# EAGLE schematic RAFT_DuckLink_RFH (EAGLE 9.5.2)

## Sheet 1 of 7
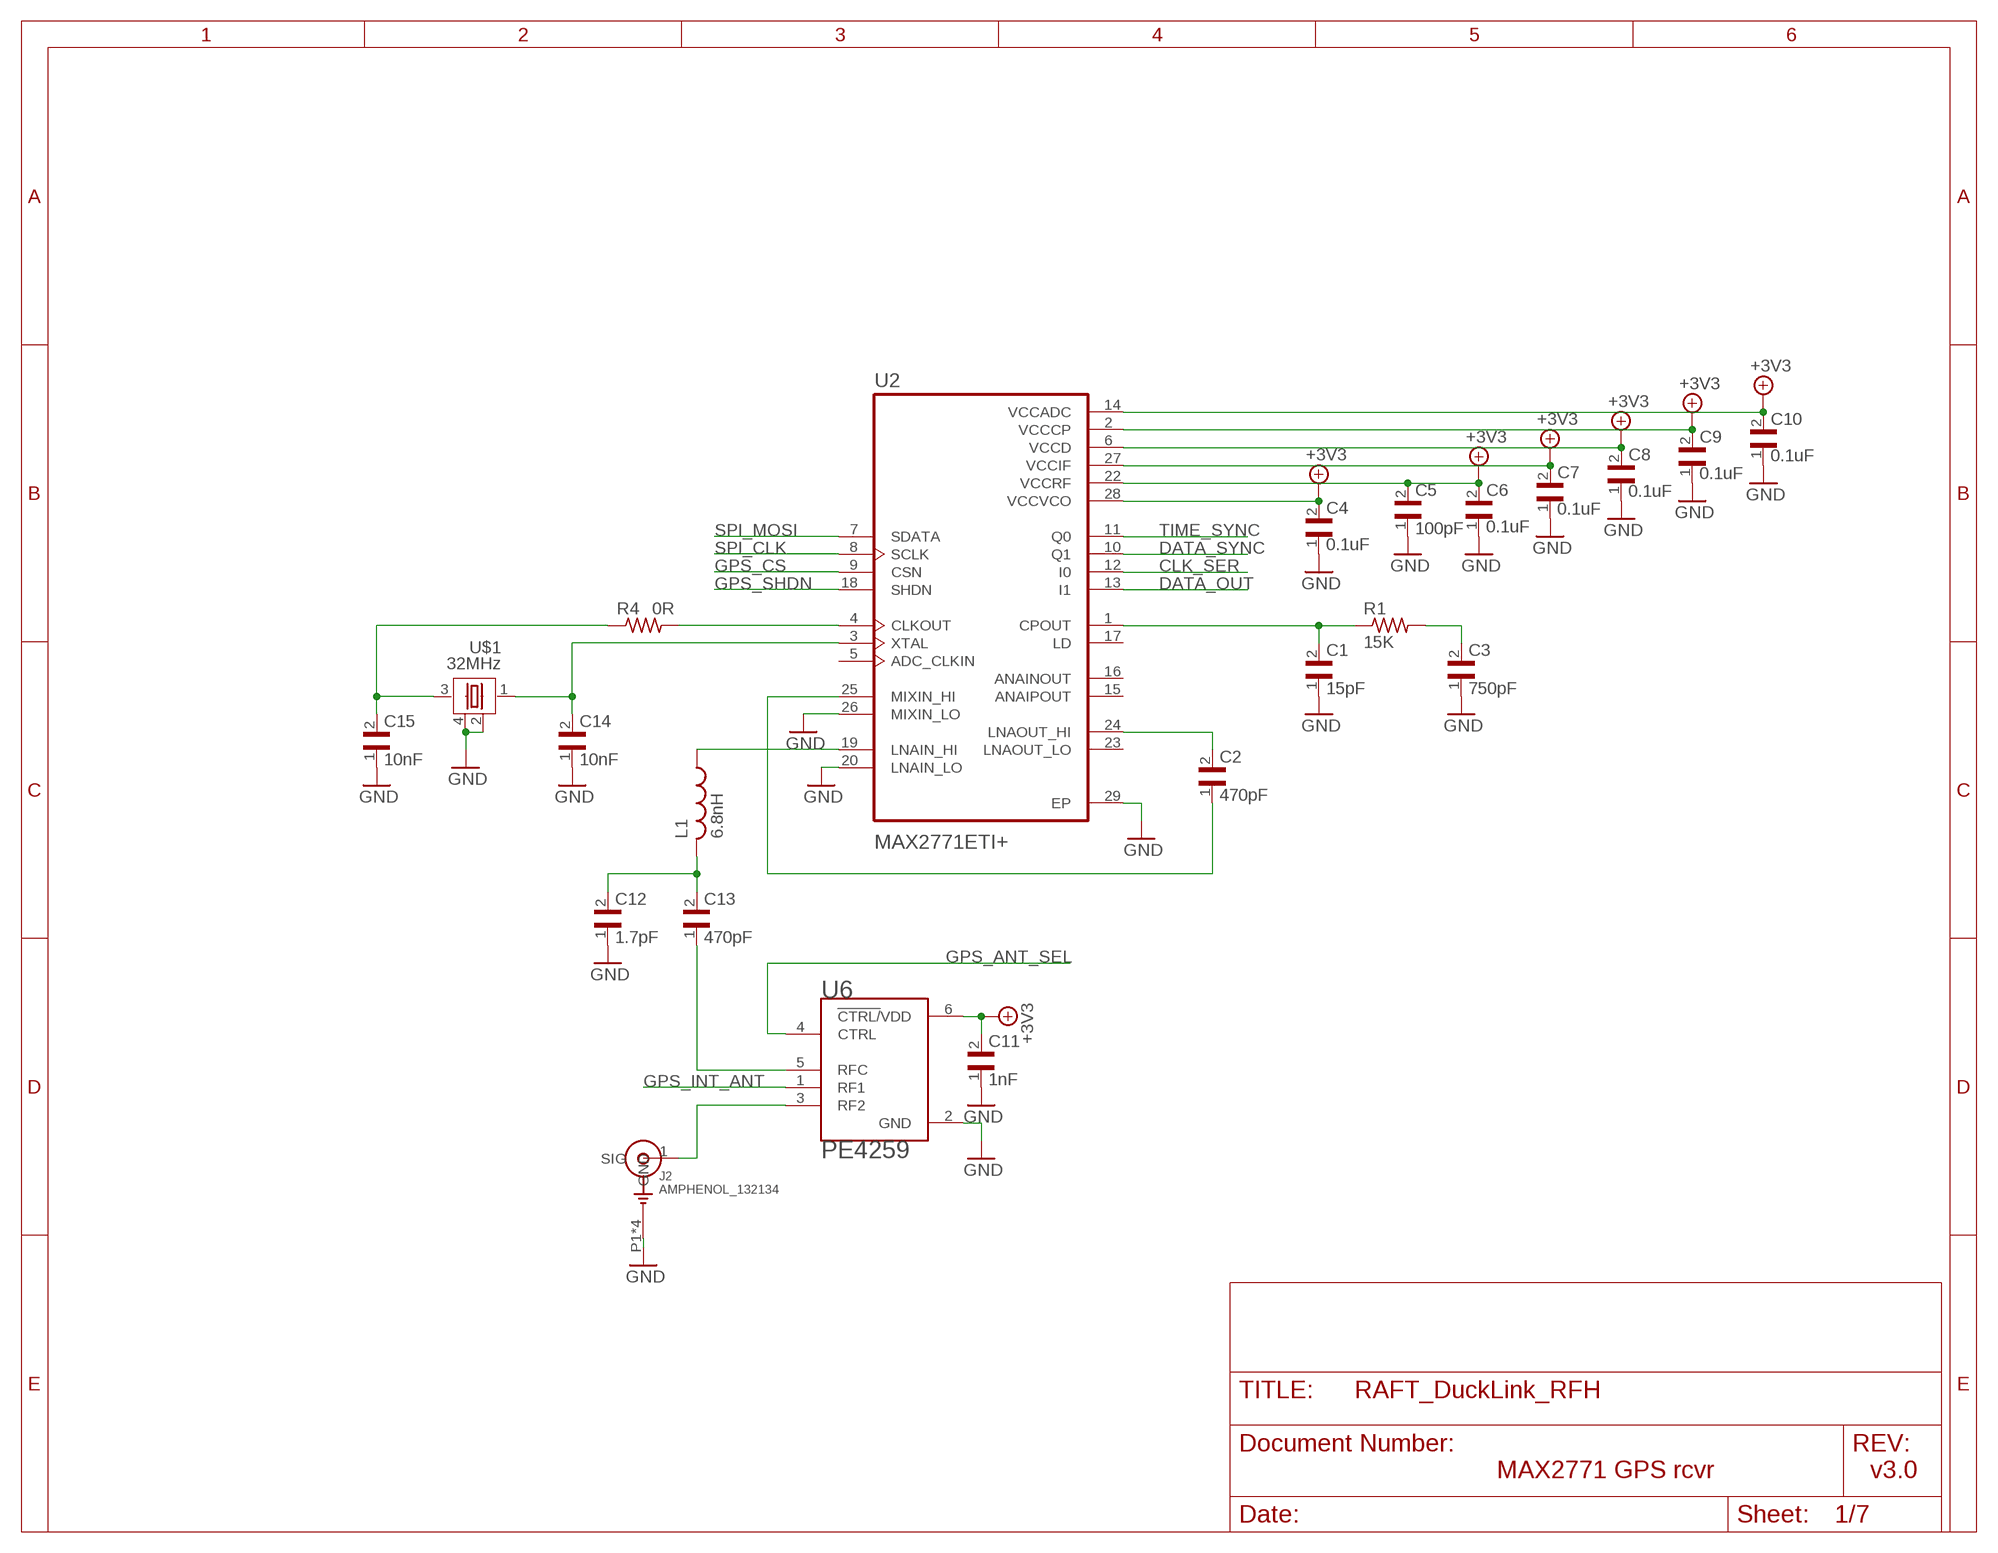
[diagram p0: schematic, sheet 1]

### Parts
C1  15pF  GCM1555C1H150JA16D  [CAPC1005X55N]
C2  470pF  GCM1555C1H471JA16D  [CAPC1005X55N]
C3  750pF  GCM1885C2A751JA16D  [CAPC1608X90N]
C4  0.1uF  GCM155R71C104KA55J  [CAPC1005X55N]
C5  100pF  GCM1555C1H101JA16D  [CAPC1005X55N]
C6  0.1uF  GCM155R71C104KA55J  [CAPC1005X55N]
C7  0.1uF  GCM155R71C104KA55J  [CAPC1005X55N]
C8  0.1uF  GCM155R71C104KA55J  [CAPC1005X55N]
C9  0.1uF  GCM155R71C104KA55J  [CAPC1005X55N]
C10  0.1uF  GCM155R71C104KA55J  [CAPC1005X55N]
C11  1nF  GCM155R71H102KA37D  [CAPC1005X55N]
C12  1.7pF  GCM1555C1H1R7CA16D  [CAPC1005X55N]
C13  470pF  GCM1555C1H471JA16D  [CAPC1005X55N]
C14  10nF  GCM155R71H103KA55D  [CAPC1005X55N]
C15  10nF  GCM155R71H103KA55D  [CAPC1005X55N]
J2  AMPHENOL_132134  [AMPHENOL_132134-15]
L1  6.8nH  LQG15HS6N8J02D  [INDC1005X55N]
R1  15K  CRCW040215K0JNED  [RESC1005X40N]
R4  0R  CRCW04020000Z0ED  [RESC1005X40N]
U2  MAX2771ETI+  [QFN50P500X500X80-29N]
U6  PE4259  [SOT65P215X110-6N]
U$1  32MHz  NX2016SA-32M  [SMD-4]

### Nets
+3.3V: C4.2 C5.2 C6.2 C7.2 C8.2 C9.2 C10.2 C11.2 U2.2(VCCCP) U2.6(VCCD) U2.14(VCCADC) U2.22(VCCRF) U2.27(VCCIF) U2.28(VCCVCO) U6.6(!CTRL/!VDD) ; supply symbol labelled +3V3 ; also sheet 2,3,5
CLK_SER: U2.12(I0) ; also sheet 3
DATA_OUT: U2.13(I1) ; also sheet 3
DATA_SYNC: U2.10(Q1) ; also sheet 3
GND: C1.1 C3.1 C4.1 C5.1 C6.1 C7.1 C8.1 C9.1 C10.1 C11.1 C12.1 C14.1 C15.1 J2.P1(GND) J2.P2(GND) J2.P3(GND) J2.P4(GND) U2.20(LNAIN_LO) U2.26(MIXIN_LO) U2.29(EP) U6.2(GND) U$1.2 U$1.4 ; also sheet 2,3,4,5,6,7
GPS_ANT_SEL: U6.4(CTRL) ; also sheet 3
GPS_CS: U2.9(CSN) ; also sheet 3
GPS_INT_ANT: U6.1(RF1) ; also sheet 7
GPS_SHDN: U2.18(SHDN) ; also sheet 3
N$1: C1.2 R1.1 U2.1(CPOUT)
N$2: C3.2 R1.2
N$3: C2.2 U2.24(LNAOUT_HI)
N$4: C2.1 U2.25(MIXIN_HI)
N$5: L1.1 U2.19(LNAIN_HI)
N$6: C13.1 U6.5(RFC)
N$7: J2.1(SIG) U6.3(RF2)
N$8: C12.2 C13.2 L1.2
N$9: C15.2 R4.1 U$1.3
N$11: C14.2 U2.3(XTAL) U$1.1
N$33: R4.2 U2.4(CLKOUT)
SPI_CLK: U2.8(SCLK) ; also sheet 2,3,7
SPI_MOSI: U2.7(SDATA) ; also sheet 2,3,7
TIME_SYNC: U2.11(Q0) ; also sheet 3
Unconnected: U2.5(ADC_CLKIN) U2.15(ANAIPOUT) U2.16(ANAINOUT) U2.17(LD) U2.23(LNAOUT_LO)

### Notes on the sheet
- MAX2771 GPS rcvr | v3.0

## Sheet 2 of 7
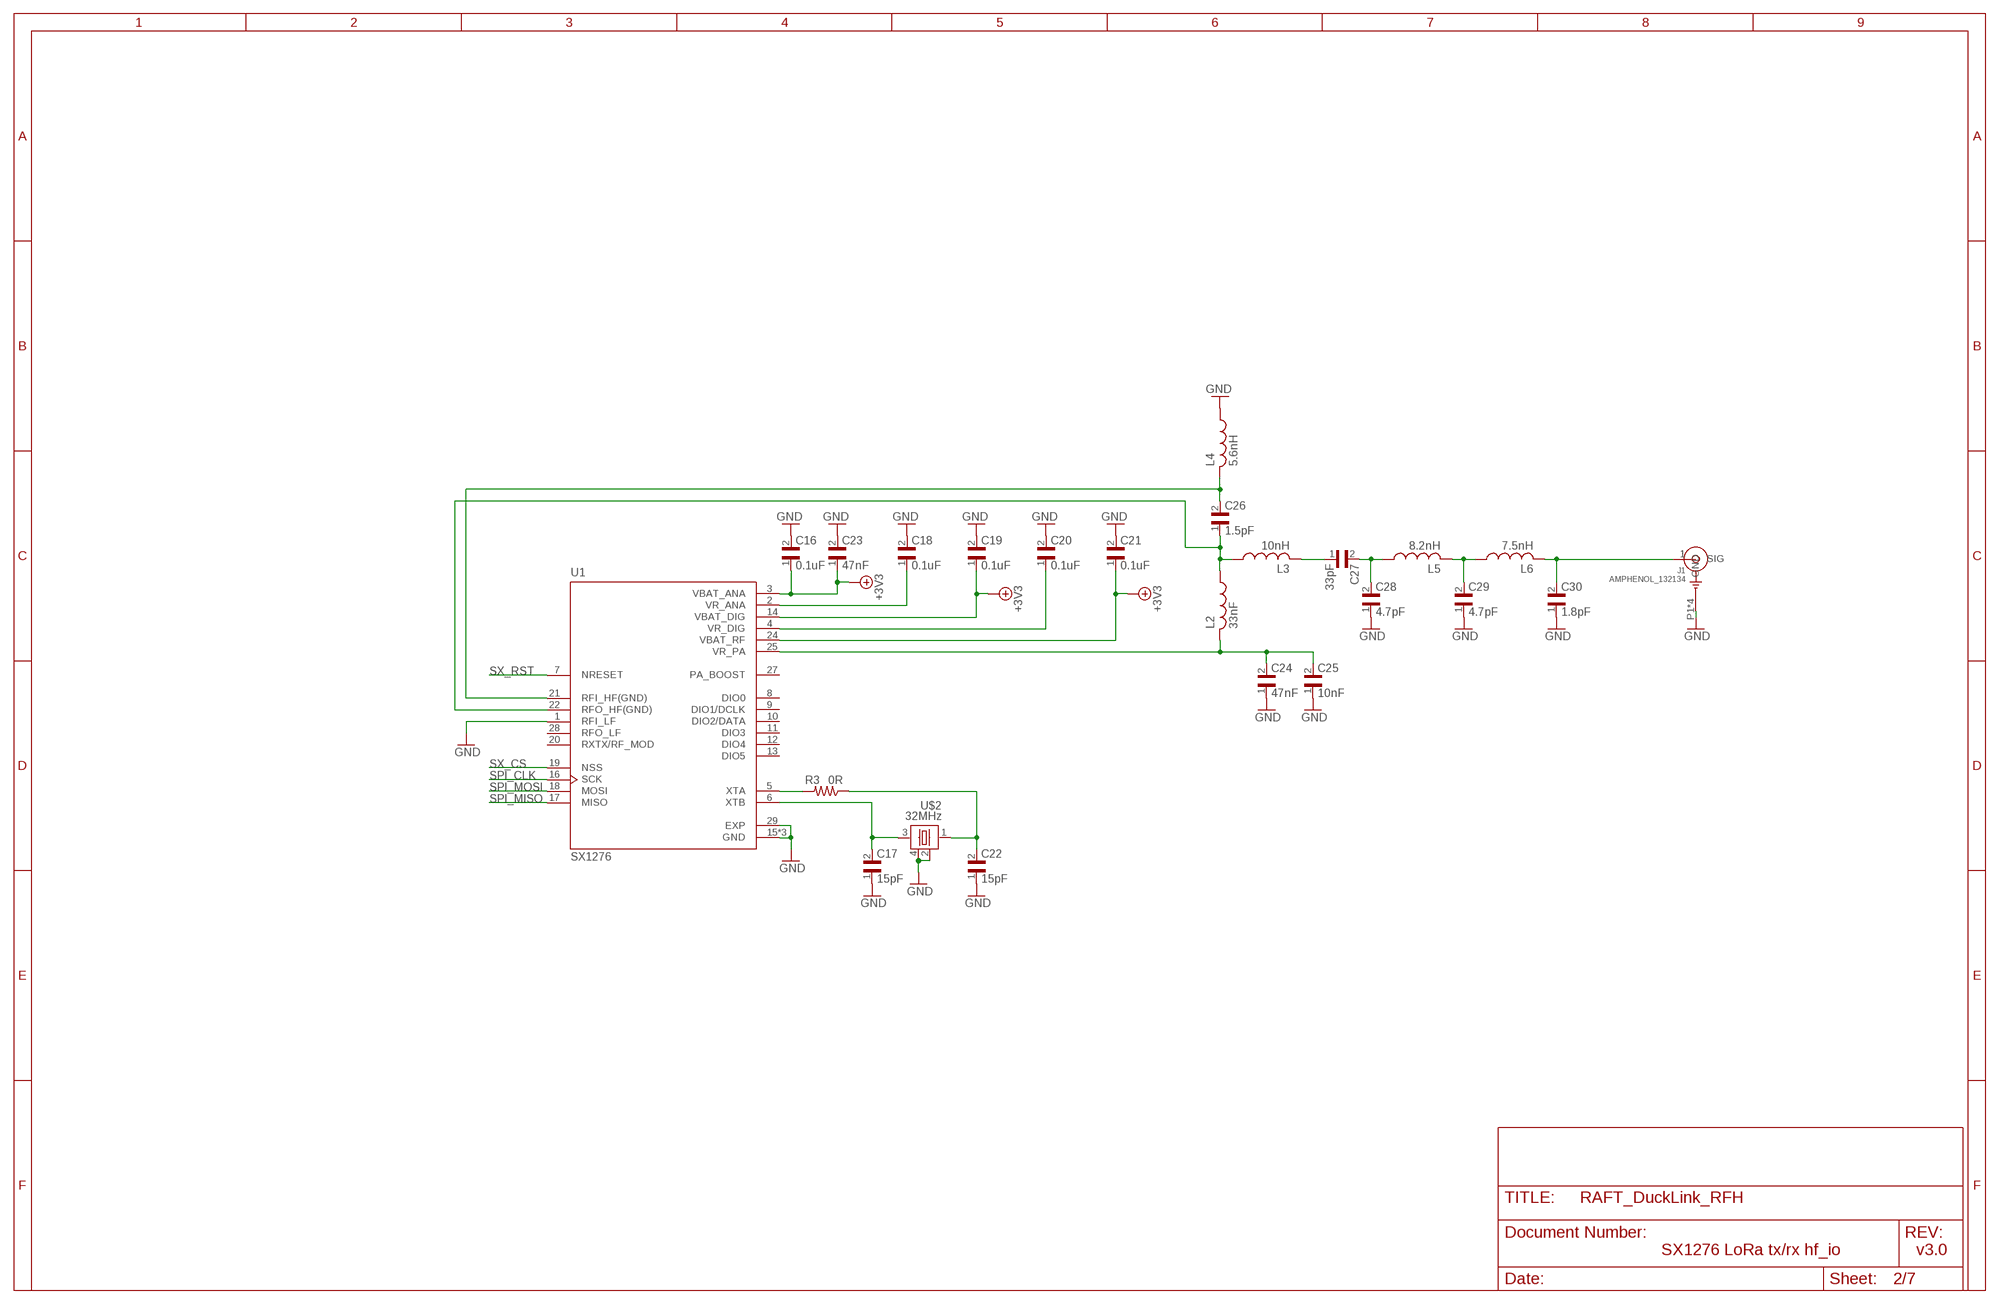
[diagram p1: schematic, sheet 2]

### Parts
C16  0.1uF  GCM155R71C104KA55J  [CAPC1005X55N]
C17  15pF  GCM1555C1H150JA16D  [CAPC1005X55N]
C18  0.1uF  GCM155R71C104KA55J  [CAPC1005X55N]
C19  0.1uF  GCM155R71C104KA55J  [CAPC1005X55N]
C20  0.1uF  GCM155R71C104KA55J  [CAPC1005X55N]
C21  0.1uF  GCM155R71C104KA55J  [CAPC1005X55N]
C22  15pF  GCM1555C1H150JA16D  [CAPC1005X55N]
C23  47nF  GCM155R71C473KA37D  [CAPC1005X55N]
C24  47nF  GCM155R71C473KA37D  [CAPC1005X55N]
C25  10nF  GCM155R71H103KA55D  [CAPC1005X55N]
C26  1.5pF  GCM1555C1H1R5JA16D  [CAPC1005X55N]
C27  33pF  GCM1555C1H330JA16D  [CAPC1005X55N]
C28  4.7pF  GCM1555C1H4R7CA16D  [CAPC1005X55N]
C29  4.7pF  GCM1555C1H4R7CA16D  [CAPC1005X55N]
C30  1.8pF  GCM1555C1H1R8CA16D  [CAPC1005X55N]
J1  AMPHENOL_132134  [AMPHENOL_132134-15]
L2  33nF  LQG15HS33NJ02D  [INDC1005X55N]
L3  10nH  LQG15HS10NJ02D  [INDC1005X55N]
L4  5.6nH  LQG15HS5N6C02D  [INDC1005X55N]
L5  8.2nH  LQG15HS8N2J02D  [INDC1005X55N]
L6  7.5nH  LQG15HN7N5H02D  [INDC1005X55N]
R3  0R  CRCW04020000Z0ED  [RESC1005X40N]
U1  SX1276  [QFN65P600X600X100-29N]
U$2  32MHz  NX2016SA-32M  [SMD-4]

### Nets
+3.3V: C16.1 C19.1 C21.1 C23.1 U1.3(VBAT_ANA) U1.14(VBAT_DIG) U1.24(VBAT_RF) ; supply symbol labelled +3V3 ; also sheet 1,3,5
GND: C16.2 C17.1 C18.2 C19.2 C20.2 C21.2 C22.1 C23.2 C24.1 C25.1 C28.1 C29.1 C30.1 J1.P1(GND) J1.P2(GND) J1.P3(GND) J1.P4(GND) L4.1 U1.1(RFI_LF) U1.15(GND) U1.23(GND) U1.26(GND) U1.29(EXP) U$2.2 U$2.4 ; also sheet 1,3,4,5,6,7
N$10: C24.2 C25.2 L2.2 U1.25(VR_PA)
N$12: C18.1 U1.2(VR_ANA)
N$13: C22.2 R3.1 U$2.1
N$14: C20.1 U1.4(VR_DIG)
N$15: C17.2 U1.6(XTB) U$2.3
N$16: C26.1 L2.1 L3.1 U1.22(RFO_HF(GND))
N$17: C26.2 L4.2 U1.21(RFI_HF(GND))
N$18: C27.1 L3.2
N$19: C27.2 C28.2 L5.1
N$20: C29.2 L5.2 L6.1
N$21: C30.2 J1.1(SIG) L6.2
N$31: R3.2 U1.5(XTA)
SPI_CLK: U1.16(SCK) ; also sheet 1,3,7
SPI_MISO: U1.17(MISO) ; also sheet 3,7
SPI_MOSI: U1.18(MOSI) ; also sheet 1,3,7
SX_CS: U1.19(NSS) ; also sheet 3
SX_RST: U1.7(NRESET) ; also sheet 3
Unconnected: U1.8(DIO0) U1.9(DIO1/DCLK) U1.10(DIO2/DATA) U1.11(DIO3) U1.12(DIO4) U1.13(DIO5) U1.20(RXTX/RF_MOD) U1.27(PA_BOOST) U1.28(RFO_LF)

### Notes on the sheet
- SX1276 LoRa tx/rx hf_io | v3.0

## Sheet 3 of 7
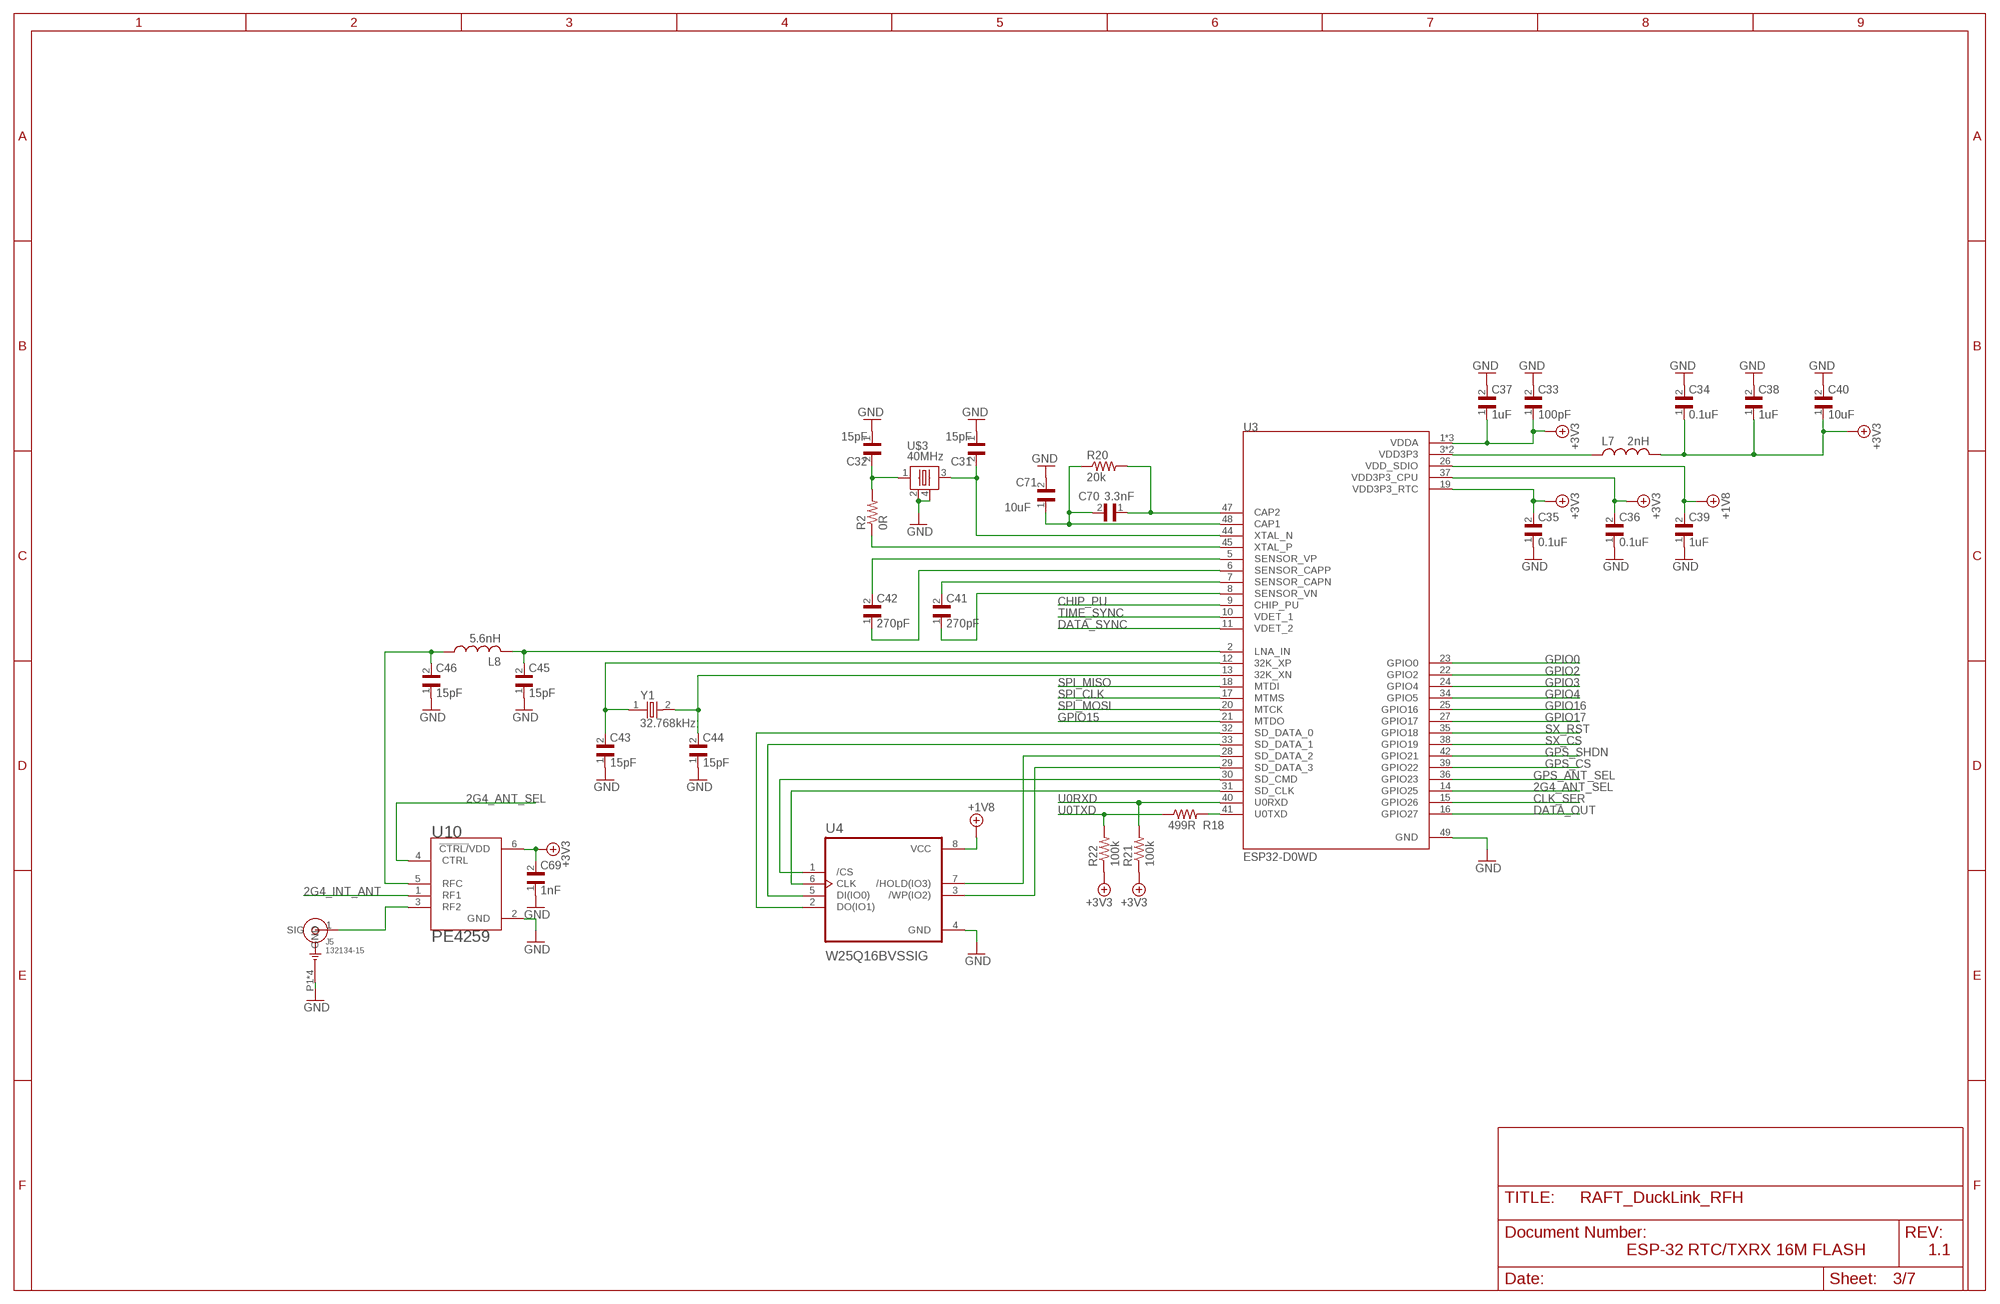
[diagram p2: schematic, sheet 3]

### Parts
C31  15pF  GCM1555C1H150JA16D  [CAPC1005X55N]
C32  15pF  GCM1555C1H150JA16D  [CAPC1005X55N]
C33  100pF  GCM1555C1H101JA16D  [CAPC1005X55N]
C34  0.1uF  GCM155R71C104KA55J  [CAPC1005X55N]
C35  0.1uF  GCM155R71C104KA55J  [CAPC1005X55N]
C36  0.1uF  GCM155R71C104KA55J  [CAPC1005X55N]
C37  1uF  GCM155C71A105KE38D  [CAPC1005X70N]
C38  1uF  GCM155C71A105KE38D  [CAPC1005X70N]
C39  1uF  GCM155C71A105KE38D  [CAPC1005X70N]
C40  10uF  GRM155C80J106ME11D  [CAPC1005X70N]
C41  270pF  GRM1555C1H271JA01D  [CAPC1005X55N]
C42  270pF  GRM1555C1H271JA01D  [CAPC1005X55N]
C43  15pF  GCM1555C1H150JA16D  [CAPC1005X55N]
C44  15pF  GCM1555C1H150JA16D  [CAPC1005X55N]
C45  15pF  GCM1555C1H150JA16D  [CAPC1005X55N]
C46  15pF  GCM1555C1H150JA16D  [CAPC1005X55N]
C69  1nF  GCM155R71H102KA37D  [CAPC1005X55N]
C70  3.3nF  GCM155R71H332KA37D  [CAPC1005X55N]
C71  10uF  GRM155C80J106ME11D  [CAPC1005X70N]
J5  132134-15  [AMPHENOL_132134-15]
L7  2nH  LQG15HN2N0C02D  [INDC1005X55N]
L8  5.6nH  LQG15HS5N6C02D  [INDC1005X55N]
R2  0R  CRCW04020000Z0ED  [RESC1005X40N]
R18  499R  CRCW0402499RFKEDC  [RESC1005X35N]
R20  20k  CRCW040220K0FKEDC  [RESC1005X35N]
R21  100k  CRCW0402100KFKED  [RESC1005X40N]
R22  100k  CRCW0402100KFKED  [RESC1005X40N]
U3  ESP32-D0WD  [QFN35P500X500X90-49N]
U4  W25Q16BVSSIG  [SOIC127P790X216-8N]
U10  PE4259  [SOT65P215X110-6N]
U$3  40MHz  R2520-40  [SMD-4]
Y1  32.768kHz  FC-13532.768KA-AG0  [OSCCC150X320X80-2N]

### Nets
2G4_ANT_SEL: U3.14(GPIO25) U10.4(CTRL)
2G4_INT_ANT: U10.1(RF1) ; also sheet 7
+1.8V: C39.2 U3.26(VDD_SDIO) U4.8(VCC) ; supply symbol labelled +1V8
+3.3V: C33.1 C34.1 C35.2 C36.2 C37.1 C38.1 C40.1 C69.2 L7.2 R21.1 R22.1 U3.1(VDDA) U3.19(VDD3P3_RTC) U3.37(VDD3P3_CPU) U3.43(VDDA) U3.46(VDDA) U10.6(!CTRL/!VDD) ; supply symbol labelled +3V3 ; also sheet 1,2,5
CHIP_PU: U3.9(CHIP_PU) ; also sheet 7
CLK_SER: U3.15(GPIO26) ; also sheet 1
DATA_OUT: U3.16(GPIO27) ; also sheet 1
DATA_SYNC: U3.11(VDET_2) ; also sheet 1
GND: C31.1 C32.1 C33.2 C34.2 C35.1 C36.1 C37.2 C38.2 C39.1 C40.2 C43.1 C44.1 C45.1 C46.1 C69.1 C71.2 J5.P1(GND) J5.P2(GND) J5.P3(GND) J5.P4(GND) U3.49(GND) U4.4(GND) U10.2(GND) U$3.2 U$3.4 ; also sheet 1,2,4,5,6,7
GPIO0: U3.23(GPIO0) ; also sheet 7
GPIO2: U3.22(GPIO2) ; also sheet 7
GPIO3: U3.24(GPIO4) ; also sheet 7
GPIO4: U3.34(GPIO5) ; also sheet 7
GPIO15: U3.21(MTDO) ; also sheet 7
GPIO16: U3.25(GPIO16) ; also sheet 7
GPIO17: U3.27(GPIO17) ; also sheet 7
GPS_ANT_SEL: U3.36(GPIO23) ; also sheet 1
GPS_CS: U3.39(GPIO22) ; also sheet 1
GPS_SHDN: U3.42(GPIO21) ; also sheet 1
N$22: R2.1 U3.45(XTAL_P)
N$23: C31.2 U3.44(XTAL_N) U$3.3
N$24: L7.1 U3.3(VDD3P3) U3.4(VDD3P3)
N$25: C41.1 U3.8(SENSOR_VN)
N$26: C41.2 U3.7(SENSOR_CAPN)
N$27: C42.1 U3.6(SENSOR_CAPP)
N$28: C42.2 U3.5(SENSOR_VP)
N$30: C32.2 R2.2 U$3.1
N$32: R18.2 U3.41(U0TXD)
N$34: U3.30(SD_CMD) U4.1(/CS)
N$35: U3.31(SD_CLK) U4.6(CLK)
N$36: U3.28(SD_DATA_2) U4.7(/HOLD(IO3))
N$37: U3.29(SD_DATA_3) U4.3(/WP(IO2))
N$38: U3.33(SD_DATA_1) U4.5(DI(IO0))
N$39: U3.32(SD_DATA_0) U4.2(DO(IO1))
N$40: C43.2 U3.12(32K_XP) Y1.1
N$41: C46.2 L8.1 U10.5(RFC)
N$42: C44.2 U3.13(32K_XN) Y1.2
N$43: C45.2 L8.2 U3.2(LNA_IN)
N$70: J5.1(SIG) U10.3(RF2)
N$71: C70.1 R20.2 U3.47(CAP2)
N$74: C70.2 C71.1 R20.1 U3.48(CAP1)
SPI_CLK: U3.17(MTMS) ; also sheet 1,2,7
SPI_MISO: U3.18(MTDI) ; also sheet 2,7
SPI_MOSI: U3.20(MTCK) ; also sheet 1,2,7
SX_CS: U3.38(GPIO19) ; also sheet 2
SX_RST: U3.35(GPIO18) ; also sheet 2
TIME_SYNC: U3.10(VDET_1) ; also sheet 1
U0RXD: R21.2 U3.40(U0RXD) ; also sheet 5,7
U0TXD: R18.1 R22.2 ; also sheet 5,7

### Notes on the sheet
- ESP-32 RTC/TXRX 16M FLASH | 1.1

## Sheet 4 of 7
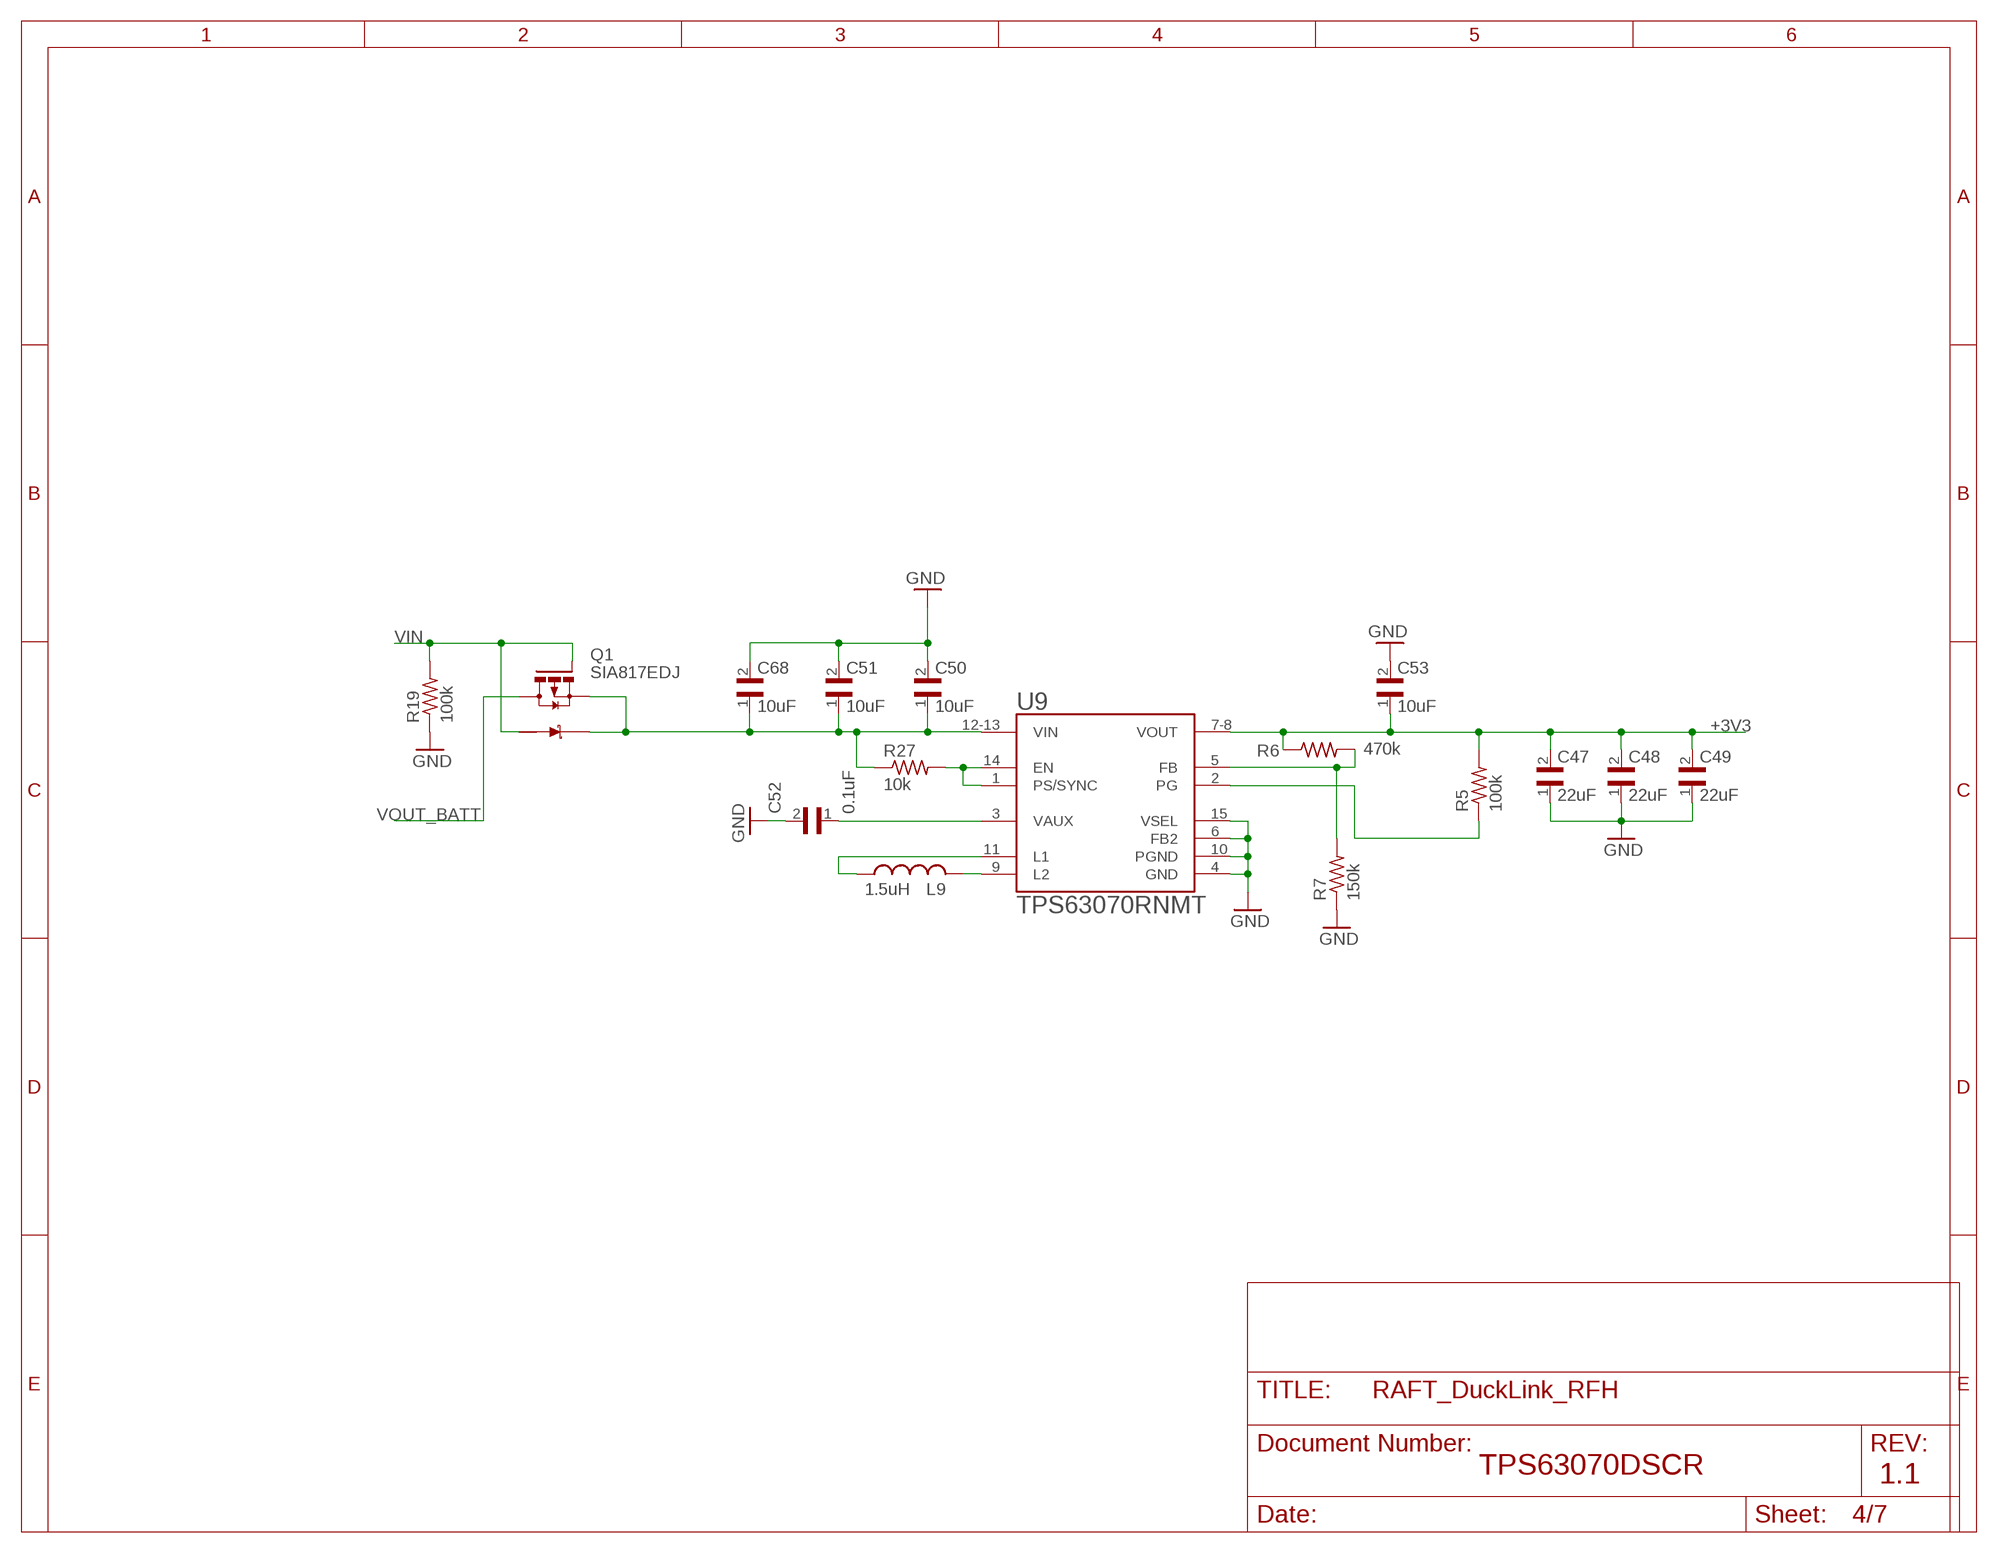
[diagram p3: schematic, sheet 4]

### Parts
C47  22uF  GRM188R60J226MEA0D  [CAPC1608X100N]
C48  22uF  GRM188R60J226MEA0D  [CAPC1608X100N]
C49  22uF  GRM188R60J226MEA0D  [CAPC1608X100N]
C50  10uF  GRM155C80J106ME11D  [CAPC1005X70N]
C51  10uF  GRM155C80J106ME11D  [CAPC1005X70N]
C52  0.1uF  GCM155R71C104KA55J  [CAPC1005X55N]
C53  10uF  GRM155C80J106ME11D  [CAPC1005X70N]
C68  10uF  GRM155C80J106ME11D  [CAPC1005X70N]
L9  1.5uH  LQM18PN1R5MFRL  [INDC1608X95N]
Q1  SIA817EDJ  [SC70-6L-DUAL]
R5  100k  CRCW0402100KFKED  [RESC1005X40N]
R6  470k  CRCW0402470KFKEDC  [RESC1005X35N]
R7  150k  CRCW0402150KFKEDC  [RESC1005X35N]
R19  100k  CRCW0402100KFKED  [RESC1005X40N]
R27  10k  CRCW040210K0JNED  [RESC1005X40N]
U9  TPS63070RNMT  [QFN50P250X300X100-15N]

### Nets
+3V3: C47.2 C48.2 C49.2 C53.1 R5.2 R6.1 U9.7-8(VOUT) ; also sheet 7
GND: C47.1 C48.1 C49.1 C50.2 C51.2 C52.2 C53.2 C68.2 R7.1 R19.1 U9.4(GND) U9.6(FB2) U9.10(PGND) U9.15(VSEL) ; also sheet 1,2,3,5,6,7
N$29: C52.1 U9.3(VAUX)
N$45: L9.1 U9.11(L1)
N$46: L9.2 U9.9(L2)
N$47: R5.1 U9.2(PG)
N$49: R6.2 R7.2 U9.5(FB)
N$57: R27.2 U9.1(PS/SYNC) U9.14(EN)
VIN: Q1.P$1(A) Q1.P$5(G) R19.2 ; also sheet 5,6
VIN_SYS: C50.1 C51.1 C68.1 Q1.P$4(S) Q1.P$6(K) R27.1 U9.12-13(VIN)
VOUT_BATT: Q1.P$3(D) ; also sheet 6

### Notes on the sheet
- TPS63070DSCR
- 1.1

## Sheet 5 of 7
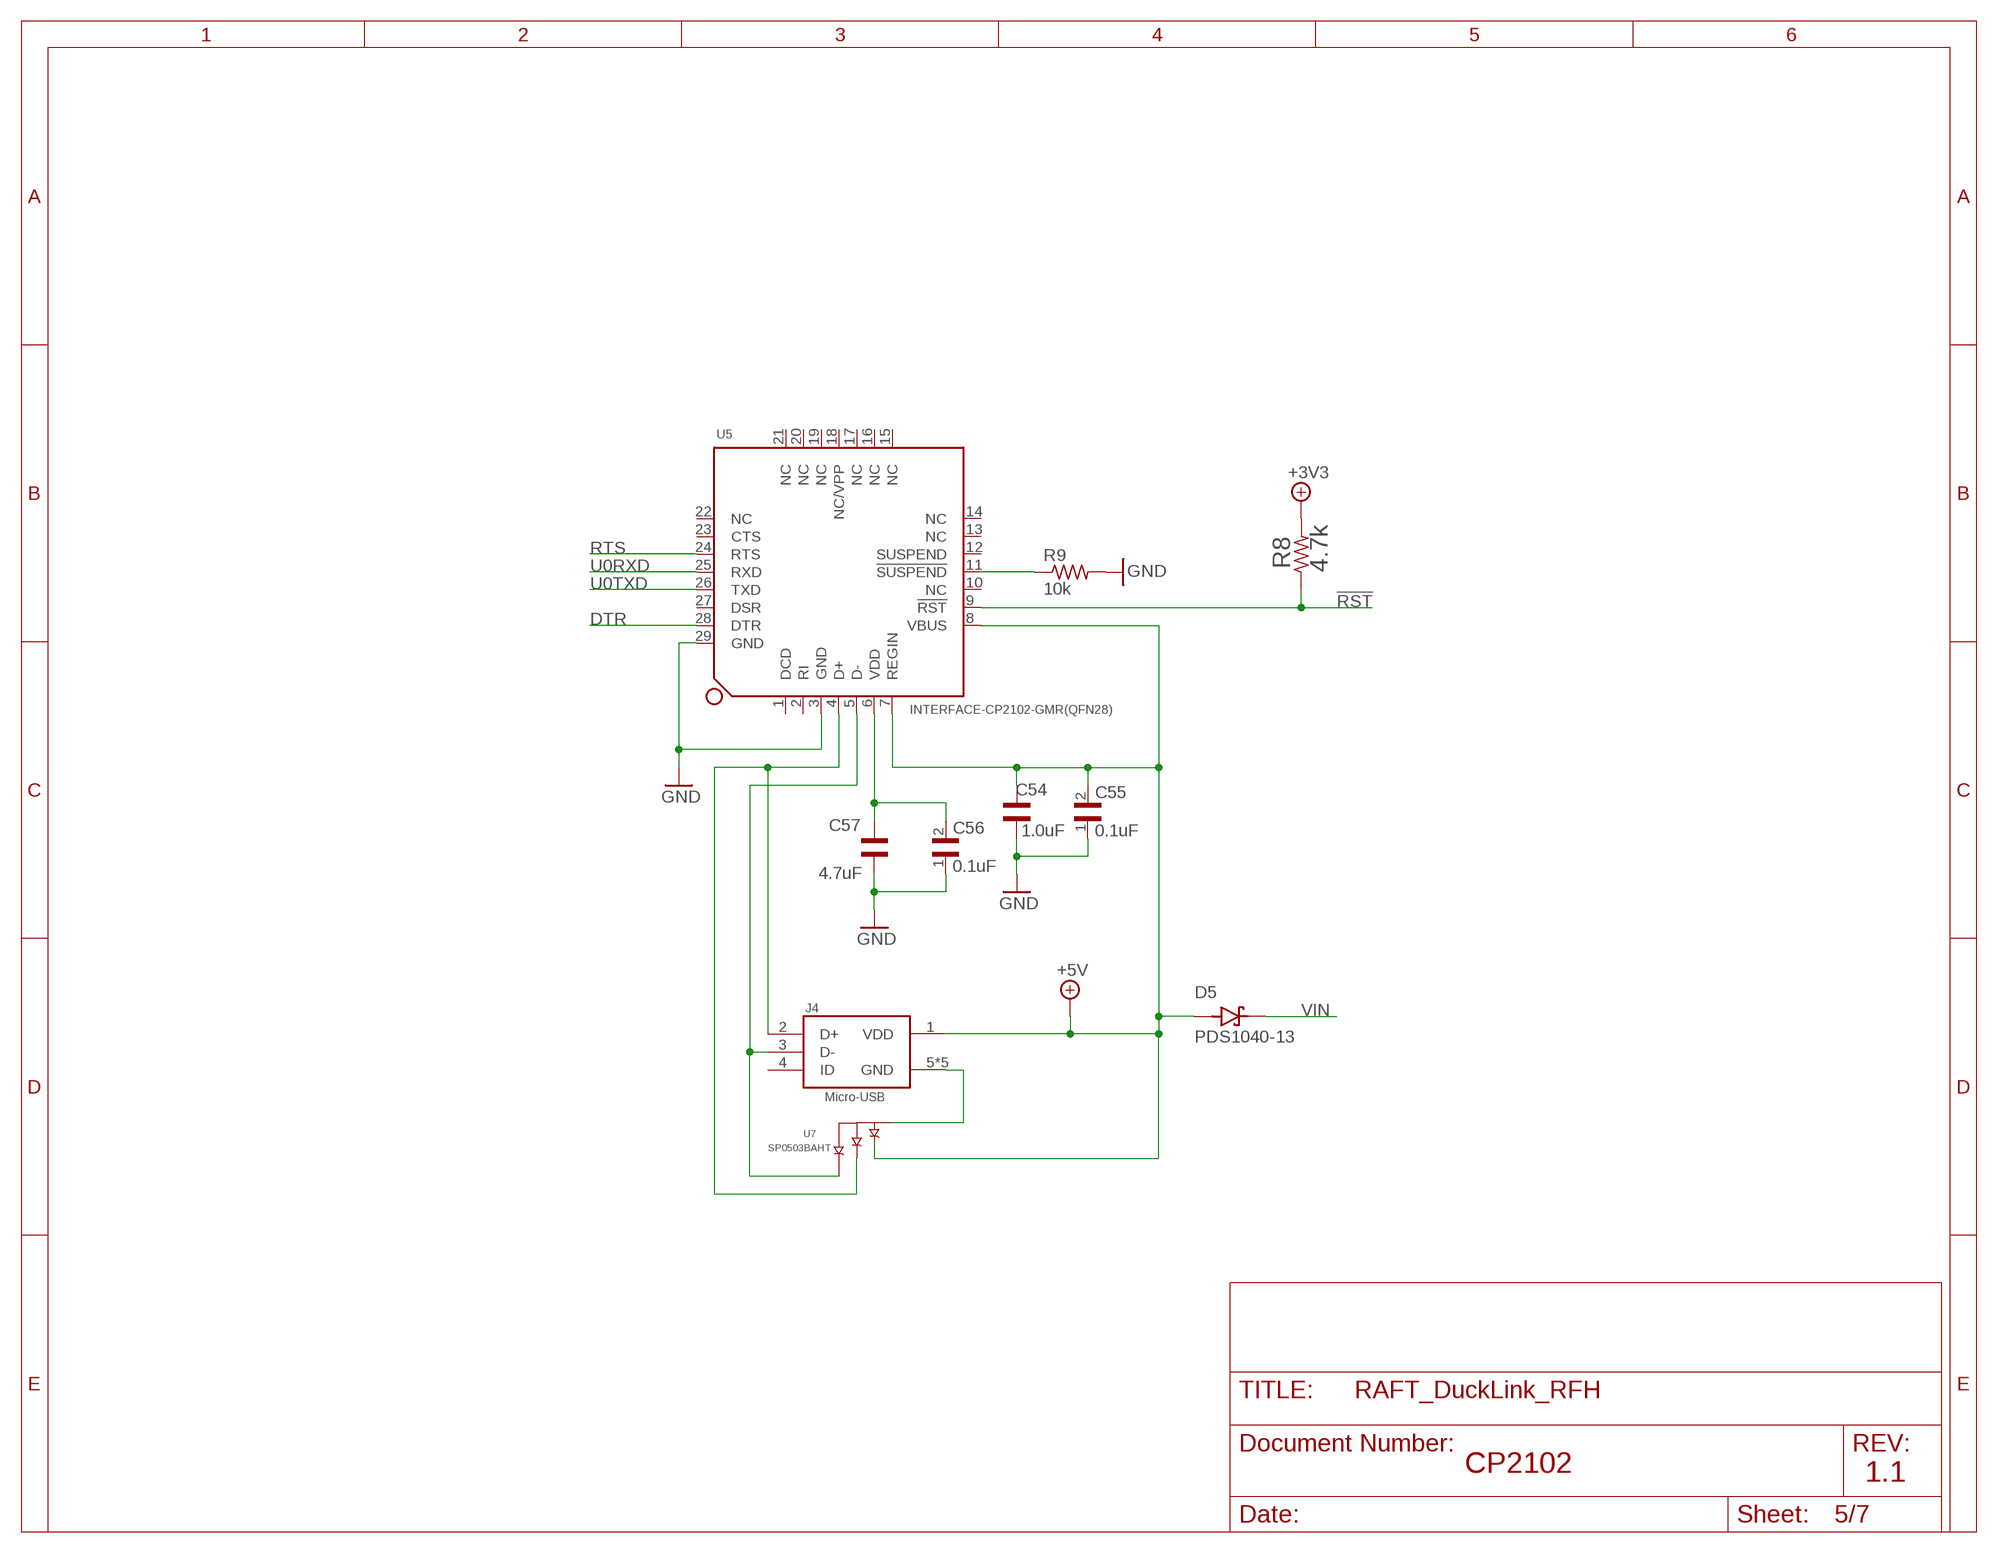
[diagram p4: schematic, sheet 5]

### Parts
C54  1.0uF  GCM155C71A105KE38D  [CAPC1005X70N]
C55  0.1uF  GCM155R71C104KA55J  [CAPC1005X55N]
C56  0.1uF  GCM155R71C104KA55J  [CAPC1005X55N]
C57  4.7uF  GRM155R60J475ME87D  [CAPC1005X55N]
D5  PDS1040-13  [DIO_PDS1040-13]
J4  Micro-USB  105017-0001FIXED  [MOLEX_105017-0001]
R8  4.7k  CRCW04024K70JNEDC  [RESC1005X35N]
R9  10k  CRCW040210K0JNED  [RESC1005X40N]
U5  INTERFACE-CP2102-GMR(QFN28)  [QFN28G_0.5-5X5MM]
U7  SP0503BAHT  [SOT143]

### Nets
!RST: R8.1 U5.9(!RST)
+3.3V: R8.2 ; supply symbol labelled +3V3 ; also sheet 1,2,3
+5V: C54.2 C55.2 D5.1(A) D5.2(A) J4.1(VDD) U5.7(REGIN) U5.8(VBUS) U7.2(A) ; also sheet 7
DTR: U5.28(DTR) ; also sheet 7
GND: C54.1 C55.1 C56.1 C57.1 R9.2 U5.3(GND) U5.29(GND) ; also sheet 1,2,3,4,6,7
N$51: R9.1 U5.11(!SUSPEND)
N$53: C56.2 C57.2 U5.6(VDD)
N$54: J4.3(D-) U5.5(D-) U7.4(C)
N$55: J4.2(D+) U5.4(D+) U7.3(B)
N$56: J4.5(GND) J4.P$1(GND) J4.P$2(GND) J4.P$8(GND) J4.P$9(GND) U7.1(GND)
RTS: U5.24(RTS) ; also sheet 7
U0RXD: U5.25(RXD) ; also sheet 3,7
U0TXD: U5.26(TXD) ; also sheet 3,7
VIN: D5.3(K) ; also sheet 4,6
Unconnected: J4.4(ID) U5.1(DCD) U5.2(RI) U5.10(NC) U5.12(SUSPEND) U5.13(NC) U5.14(NC) U5.15(NC) U5.16(NC) U5.17(NC) U5.18(NC/VPP) U5.19(NC) U5.20(NC) U5.21(NC) U5.22(NC) U5.23(CTS) U5.27(DSR)

### Notes on the sheet
- CP2102
- 1.1

## Sheet 6 of 7
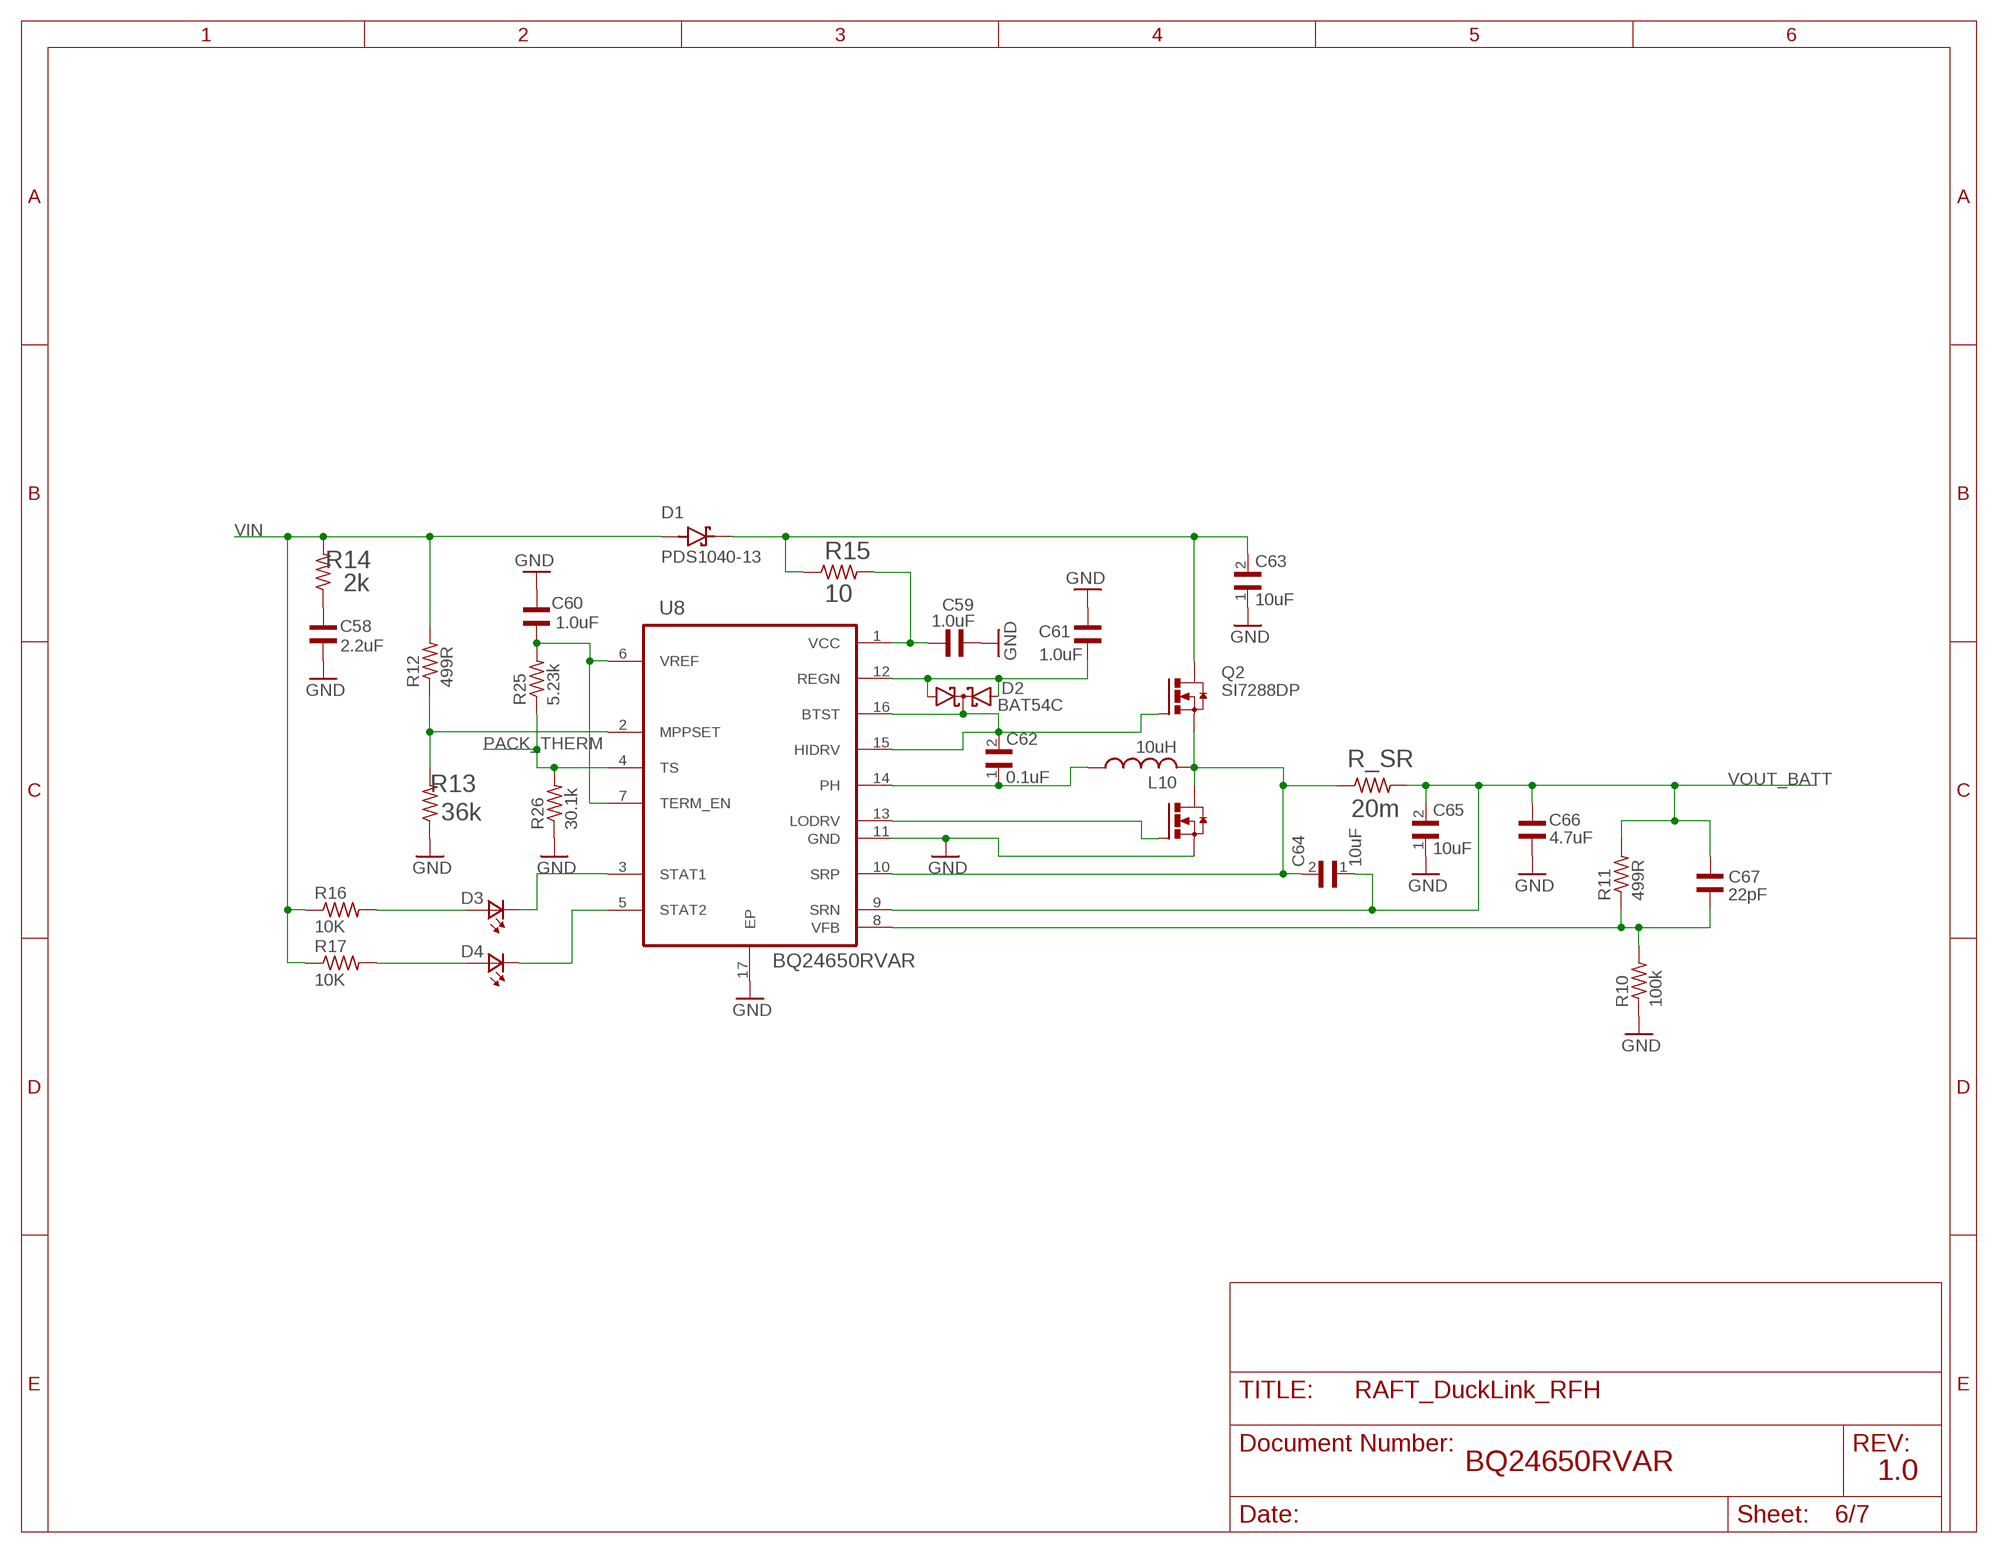
[diagram p5: schematic, sheet 6]

### Parts
C58  2.2uF  GRM155D80J225ME95D  [CAPC1005X55N]
C59  1.0uF  GCM155C71A105KE38D  [CAPC1005X70N]
C60  1.0uF  GCM155C71A105KE38D  [CAPC1005X70N]
C61  1.0uF  GCM155C71A105KE38D  [CAPC1005X70N]
C62  0.1uF  GCM155R71C104KA55J  [CAPC1005X55N]
C63  10uF  GRM155C80J106ME11D  [CAPC1005X70N]
C64  10uF  GRM155C80J106ME11D  [CAPC1005X70N]
C65  10uF  GRM155C80J106ME11D  [CAPC1005X70N]
C66  4.7uF  GRM155R60J475ME87D  [CAPC1005X55N]
C67  22pF  GCM1555C1H220JA16J  [CAPC1005X55N]
D1  PDS1040-13  [DIO_PDS1040-13]
D2  BAT54C  [SOT23]
D3  LTST-C190GKT  [0603]
D4  LTST-C190GKT  [0603]
L10  10uH  LQM18FN100M00D  [INDC1608X90N]
Q2  SI7288DP  [POWERPAK-SO8_1]
R10  100k  CRCW0402100KFKED  [RESC1005X40N]
R11  499R  CRCW0402499RFKEDC  [RESC1005X35N]
R12  499R  CRCW0402499RFKEDC  [RESC1005X35N]
R13  36k  CRCW040236K0FKED  [RESC1005X40N]
R14  2k  CRCW04022K00FKED  [RESC1005X40N]
R15  10  CRCW040210R0JNEDC  [RESC1005X35N]
R16  10K  CRCW040210K0JNED  [RESC1005X40N]
R17  10K  CRCW040210K0JNED  [RESC1005X40N]
R25  5.23k  CRCW04025K23FKED  [RESC1005X40N]
R26  30.1k  CRCW040230K1FKED  [RESC1005X40N]
R_SR  20m  ERJ-3BWFR020V  [RESC1608X55N]
U8  BQ24650RVAR  [QFN50P350X350X100-17N]

### Nets
GND: C58.1 C59.2 C60.2 C61.2 C63.1 C65.1 C66.1 Q2.3(S1) R10.1 R13.1 R26.1 U8.11(GND) U8.17(EP) ; also sheet 1,2,3,4,5,7
N$48: Q2.4(G1) U8.13(LODRV)
N$50: C60.1 R25.2 U8.6(VREF) U8.7(TERM_EN)
N$58: R12.1 R13.2 U8.2(MPPSET)
N$59: C59.1 R15.2 U8.1(VCC)
N$60: C61.1 D2.1(A1) D2.2(A2) U8.12(REGN)
N$61: C62.2 D2.3(CC) Q2.2(G) U8.15(HIDRV) U8.16(BTST)
N$62: C67.1 R10.2 R11.1 U8.8(VFB)
N$63: C64.2 L10.2 Q2.1(S) Q2.5(D1) Q2.6(D1) R_SR.1 U8.10(SRP)
N$65: D4.2(A2) R17.2
N$66: D3.2(A2) R16.2
N$67: D4.1(K2) U8.5(STAT2)
N$68: D3.1(K2) U8.3(STAT1)
N$69: C62.1 L10.1 U8.14(PH)
N$72: C58.2 R14.1
PACK_THERM: R25.1 R26.2 U8.4(TS)
SC_VIN: C63.2 D1.3(K) Q2.7(D) Q2.8(D) R15.1
VIN: D1.1(A) D1.2(A) R12.2 R14.2 R16.1 R17.1 ; also sheet 4,5
VOUT_BATT: C64.1 C65.2 C66.2 C67.2 R11.2 R_SR.2 U8.9(SRN) ; also sheet 4

### Notes on the sheet
- BQ24650RVAR
- 1.0

## Sheet 7 of 7
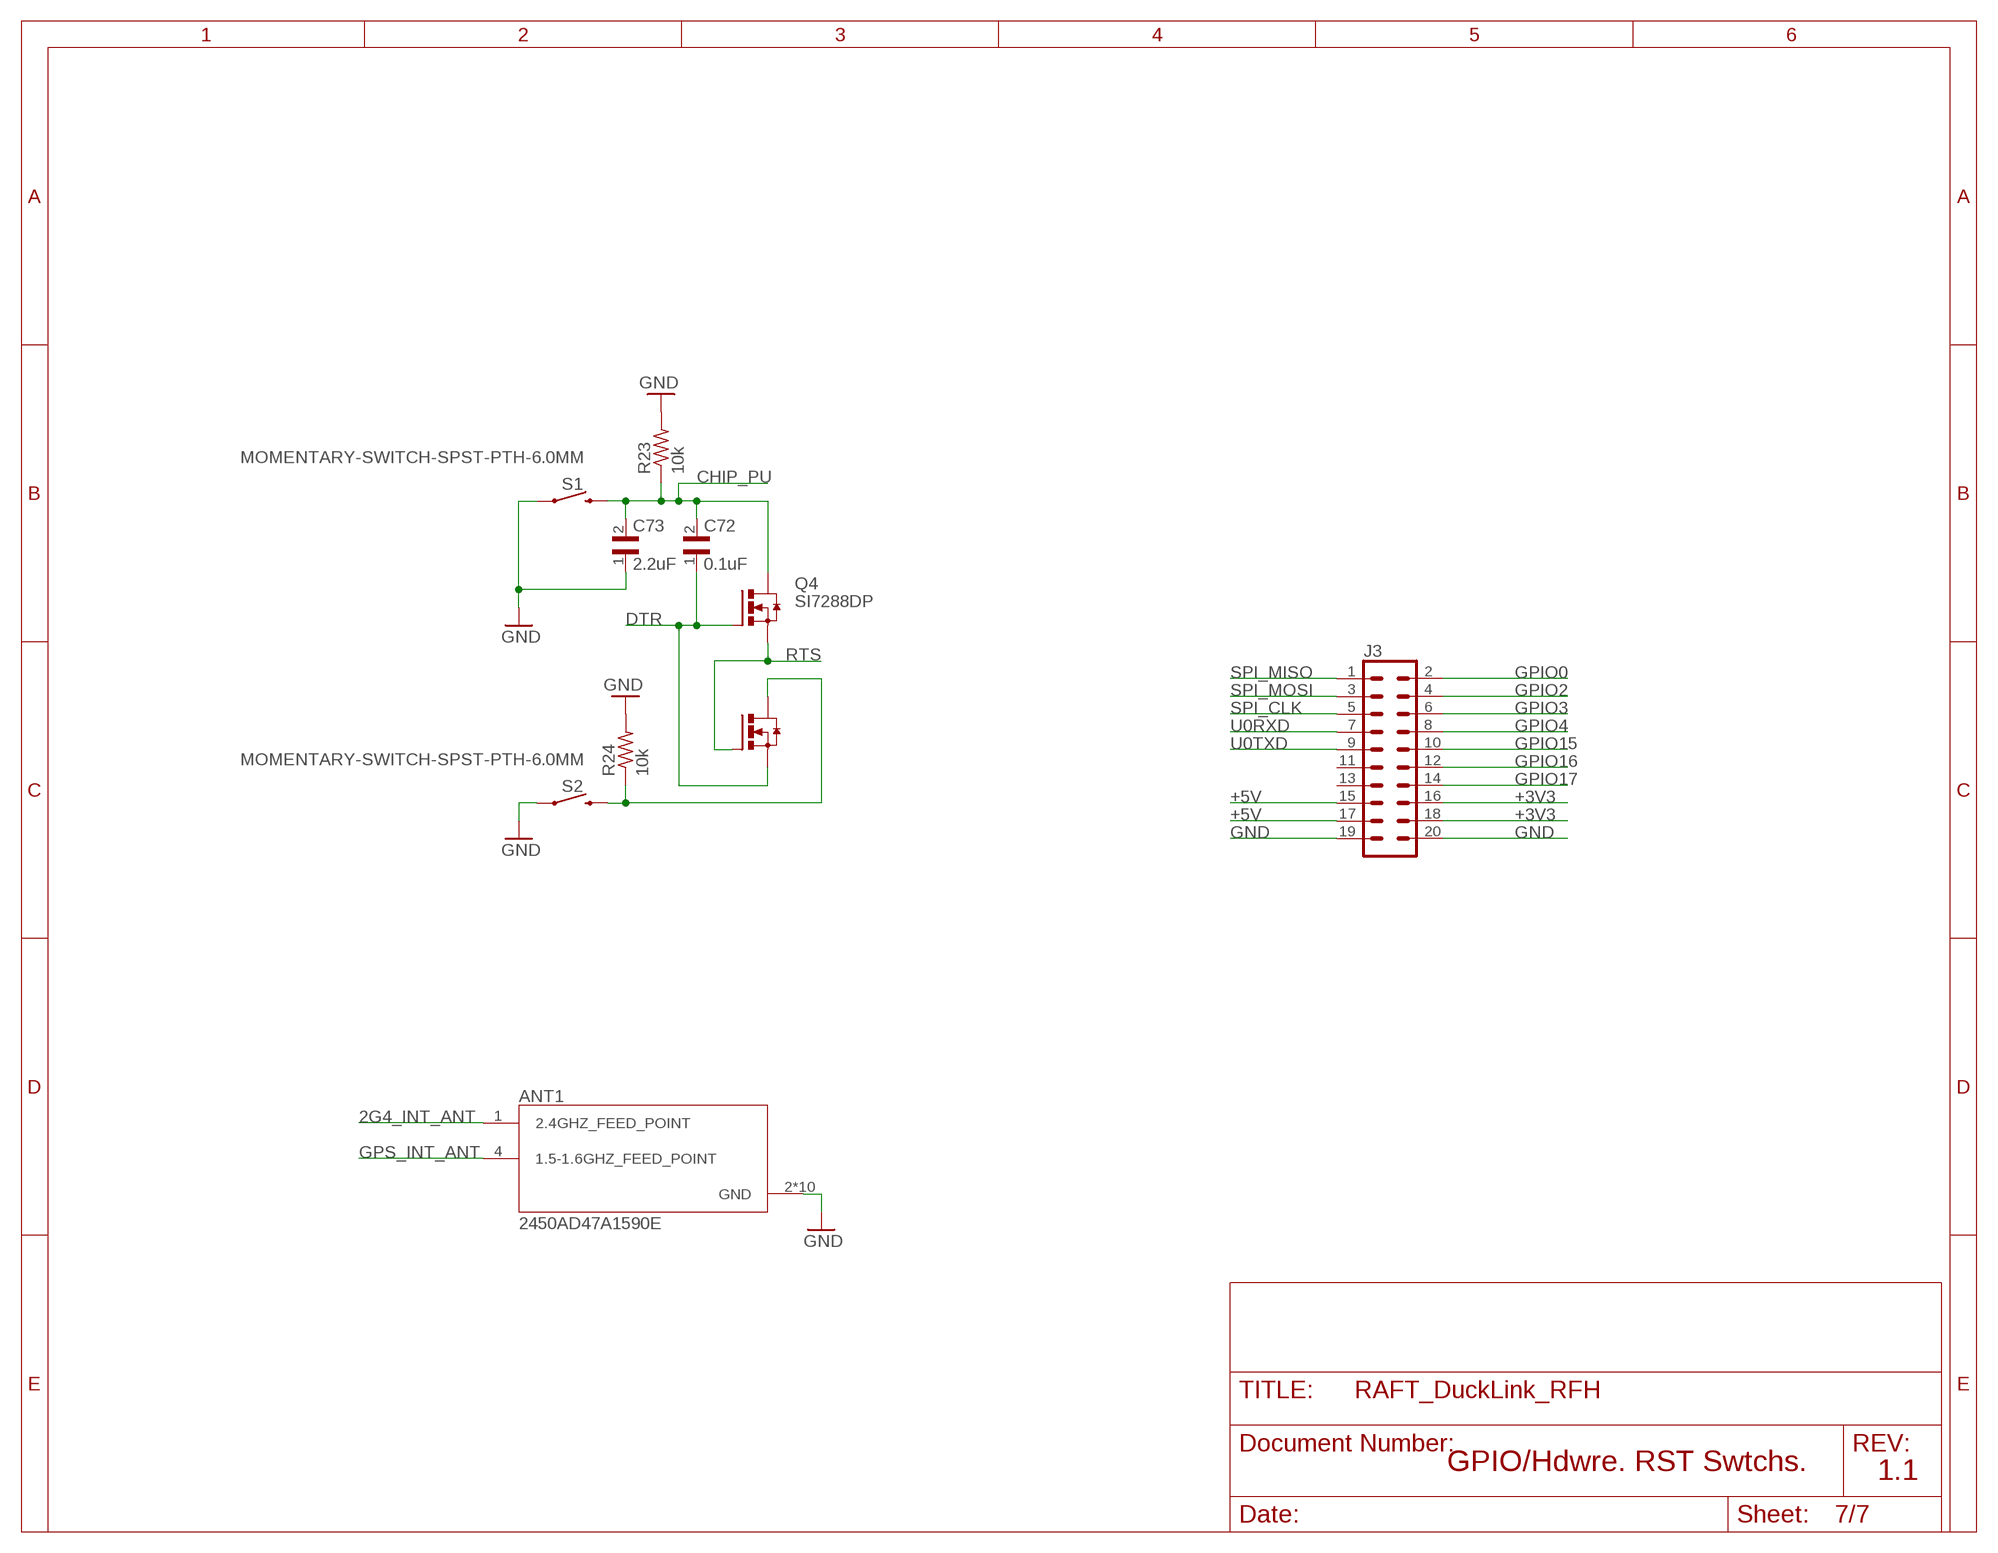
[diagram p6: schematic, sheet 7]

### Parts
ANT1  2450AD47A1590E  [ANT_2450AD47A1590E]
C72  0.1uF  GCM155R71C104KA55J  [CAPC1005X55N]
C73  2.2uF  GRM155D80J225ME95D  [CAPC1005X55N]
J3  CONN_10X2  [2X10]
Q4  SI7288DP  [POWERPAK-SO8_1]
R23  10k  CRCW040210K0JNED  [RESC1005X40N]
R24  10k  CRCW040210K0JNED  [RESC1005X40N]
S1  MOMENTARY-SWITCH-SPST-PTH-6.0MM  [TACTILE_SWITCH_PTH_6.0MM]
S2  MOMENTARY-SWITCH-SPST-PTH-6.0MM  [TACTILE_SWITCH_PTH_6.0MM]

### Nets
2G4_INT_ANT: ANT1.1(2.4GHZ_FEED_POINT) ; also sheet 3
+3V3: J3.16 J3.18 ; also sheet 4
+5V: J3.15 J3.17 ; also sheet 5
CHIP_PU: C72.2 C73.2 Q4.7(D) Q4.8(D) R23.1 S1.3 ; also sheet 3
DTR: C72.1 Q4.2(G) Q4.3(S1) ; also sheet 5
GND: ANT1.2(GND) ANT1.3(GND) ANT1.5(GND) ANT1.6(GND) ANT1.7(GND) ANT1.8(GND) ANT1.9(GND) ANT1.10(GND) ANT1.11(GND) ANT1.12(GND) C73.1 J3.19 J3.20 R23.2 R24.2 S1.1 S2.1 ; also sheet 1,2,3,4,5,6
GPIO0: J3.2 ; also sheet 3
GPIO2: J3.4 ; also sheet 3
GPIO3: J3.6 ; also sheet 3
GPIO4: J3.8 ; also sheet 3
GPIO15: J3.10 ; also sheet 3
GPIO16: J3.12 ; also sheet 3
GPIO17: J3.14 ; also sheet 3
GPS_INT_ANT: ANT1.4(1.5-1.6GHZ_FEED_POINT) ; also sheet 1
N$44: Q4.5(D1) Q4.6(D1) R24.1 S2.3
RTS: Q4.1(S) Q4.4(G1) ; also sheet 5
SPI_CLK: J3.5 ; also sheet 1,2,3
SPI_MISO: J3.1 ; also sheet 2,3
SPI_MOSI: J3.3 ; also sheet 1,2,3
U0RXD: J3.7 ; also sheet 3,5
U0TXD: J3.9 ; also sheet 3,5
Unconnected: J3.11 J3.13

### Notes on the sheet
- GPIO/Hdwre. RST Swtchs.
- 1.1

## Library data of the parts
ANT1 = RAFT-components:2450AD47A1590E: Antenna Ceramic Chip -1dBi/-2.5dBi/-2dBi Gain 2500MHz 8-Pin SMD T/R; DESCRIPTION: 1.561GHz, 1.575GHz, 1.602GHz, 2.4GHz Beidou, Bluetooth, GLONASS, GPS, Wi-Fi Chip RF Antenna 1.561GHz ~ 1.602GHz, 2.4GHz ~ 2.5GHz 0.5dBi, 1.5dBi, 1.5dBi, 1dBi Solder Surface Mount; DIGI-KEY_PART_NUMBER: 712-1594-1-ND; DIGI-KEY_PURCHASE_URL: https://www.digikey.com/product-detail/en/johanson-technology-inc/2450AD47A1590E/712-1594-1-ND/5980452?utm_source=snapeda&utm_medium=aggregator&utm_campaign=symbol; MF: Johanson Technology; MP: 2450AD47A1590E; PACKAGE: FBGA-780 Johanson Technology
C1 C43-C46 = rcl-raft:GCM1555C1H150JA16D: Cap Ceramic 15pF 50V C0G 5% Pad SMD 0402 125C Automotive T/R; DESCRIPTION: Cap Ceramic 15pF 50V C0G 5% Pad SMD 0402 125C Automotive T/R; DIGI-KEY_PART_NUMBER: 490-11147-1-ND; DIGI-KEY_PURCHASE_URL: https://www.digikey.com/product-detail/en/murata-electronics/GCM1555C1H150JA16D/490-11147-1-ND/5332987?utm_source=snapeda&utm_medium=aggregator&utm_campaign=symbol; MF: Murata; MP: GCM1555C1H150JA16D; PACKAGE: 1005 Taiyo Yuden
C2 C13 = rcl-raft:GCM1555C1H471JA16D: Cap Ceramic 470pF 50V C0G/NP0 5% Pad SMD 0402 125C Automotive T/R; DESCRIPTION: CAP CER 470PF 50V C0G/NP0 0402; DIGI-KEY_PART_NUMBER: 490-4758-1-ND; DIGI-KEY_PURCHASE_URL: https://www.digikey.com/product-detail/en/murata-electronics/GCM1555C1H471JA16D/490-4758-1-ND/1641677?utm_source=snapeda&utm_medium=aggregator&utm_campaign=symbol; MF: Murata; MP: GCM1555C1H471JA16D; PACKAGE: 1005 Taiyo Yuden
C3 = rcl-raft:GCM1885C2A751JA16D: Cap Ceramic 750pF 100V C0G 5% SMD 0603 125°C Paper T/R; DESCRIPTION: Cap Ceramic 750pF 100V C0G 5% SMD 0603 125°C Paper T/R; DIGI-KEY_PART_NUMBER: GCM1885C2A751JA16D-ND; DIGI-KEY_PURCHASE_URL: https://www.digikey.com/product-detail/en/murata-electronics/GCM1885C2A751JA16D/GCM1885C2A751JA16D-ND/2591804?utm_source=snapeda&utm_medium=aggregator&utm_campaign=symbol; MF: Murata; MP: GCM1885C2A751JA16D; PACKAGE: 1608 Murata
C4 C6-C10 C34-C36 = rcl-raft:GCM155R71C104KA55J: Cap Ceramic 0.1uF 16V X7R 10% Pad SMD 0402 125°C Automotive T/R; DESCRIPTION: Cap Ceramic 0.1uF 16V X7R 10% Pad SMD 0402 125°C Automotive T/R; DIGI-KEY_PART_NUMBER: 490-7998-1-ND; DIGI-KEY_PURCHASE_URL: https://www.digikey.com/product-detail/en/murata-electronics/GCM155R71C104KA55J/490-7998-1-ND/4380283?utm_source=snapeda&utm_medium=aggregator&utm_campaign=symbol; MF: Murata; MP: GCM155R71C104KA55J; PACKAGE: 1005 Taiyo Yuden
C5 C33 = rcl-raft:GCM1555C1H101JA16D: Cap Ceramic 100pF 50V C0G 10% Pad SMD 0402 125°C Automotive T/R; DESCRIPTION: 100pF ±5% 50V Ceramic Capacitor C0G, NP0 0402 _1005 Metric_; DIGI-KEY_PART_NUMBER: 490-10669-1-ND; DIGI-KEY_PURCHASE_URL: https://www.digikey.com/product-detail/en/murata-electronics/GCM1555C1H101JA16D/490-10669-1-ND/5251436?utm_source=snapeda&utm_medium=aggregator&utm_campaign=symbol; MF: Murata; MP: GCM1555C1H101JA16D; PACKAGE: 1005 Taiyo Yuden
C11 C69 = rcl-raft:GCM155R71H102KA37D: Cap Ceramic 0.001uF 50V X7R 10% Pad SMD 0402 125C Automotive T/R; DESCRIPTION: Cap Ceramic 0.001uF 50V X7R 10% Pad SMD 0402 125C Automotive T/R; DIGI-KEY_PART_NUMBER: 490-4761-1-ND; DIGI-KEY_PURCHASE_URL: https://www.digikey.com/product-detail/en/murata-electronics/GCM155R71H102KA37D/490-4761-1-ND/1641680?utm_source=snapeda&utm_medium=aggregator&utm_campaign=symbol; MF: Murata; MP: GCM155R71H102KA37D; PACKAGE: 1005 Taiyo Yuden
C12 = rcl-raft:GCM1555C1H1R7CA16D: CAP CER 1.7PF 50V NP0 0402; DESCRIPTION: Cap Auto-Grade 1.7pf 50vdc C0g 0.25pf Smd 0402; DIGI-KEY_PART_NUMBER: GCM1555C1H1R7CA16D-ND; DIGI-KEY_PURCHASE_URL: https://www.digikey.com/product-detail/en/murata-electronics/GCM1555C1H1R7CA16D/GCM1555C1H1R7CA16D-ND/4903569?utm_source=snapeda&utm_medium=aggregator&utm_campaign=symbol; MF: Murata; MP: GCM1555C1H1R7CA16D; PACKAGE: 1005 Taiyo Yuden
C14 C15 = rcl-raft:GCM155R71H103KA55D: 10000pF ±10% 50V Ceramic Capacitor X7R 0402 (1005 Metric); COPYRIGHT: Copyright (C) 2015 Accelerated Designs. All rights reserved; MANUFACTURER_PART_NUMBER: GCM155R71H103KA55D; VENDOR: Murata
C16 C18-C21 C52 C55 C56 C62 C72 = RAFT-components:GCM155R71C104KA55J: Cap Ceramic 0.1uF 16V X7R 10% Pad SMD 0402 125°C Automotive T/R; DESCRIPTION: Cap Ceramic 0.1uF 16V X7R 10% Pad SMD 0402 125°C Automotive T/R; DIGI-KEY_PART_NUMBER: 490-7998-1-ND; DIGI-KEY_PURCHASE_URL: https://www.digikey.com/product-detail/en/murata-electronics/GCM155R71C104KA55J/490-7998-1-ND/4380283?utm_source=snapeda&utm_medium=aggregator&utm_campaign=symbol; MF: Murata; MP: GCM155R71C104KA55J; PACKAGE: 1005 Taiyo Yuden
C17 C22 C31 C32 = RAFT-components:GCM1555C1H150JA16D: Cap Ceramic 15pF 50V C0G 5% Pad SMD 0402 125C Automotive T/R; DESCRIPTION: Cap Ceramic 15pF 50V C0G 5% Pad SMD 0402 125C Automotive T/R; DIGI-KEY_PART_NUMBER: 490-11147-1-ND; DIGI-KEY_PURCHASE_URL: https://www.digikey.com/product-detail/en/murata-electronics/GCM1555C1H150JA16D/490-11147-1-ND/5332987?utm_source=snapeda&utm_medium=aggregator&utm_campaign=symbol; MF: Murata; MP: GCM1555C1H150JA16D; PACKAGE: 1005 Taiyo Yuden
C23 C24 = RAFT-components:GCM155R71C473KA37D: Cap Ceramic 0.047uF 16V X7R 10% Pad SMD 0402 125C Automotive T/R; DESCRIPTION: Cap Ceramic 0.047uF 16V X7R 10% Pad SMD 0402 125C Automotive T/R; DIGI-KEY_PART_NUMBER: 490-6042-1-ND; DIGI-KEY_PURCHASE_URL: https://www.digikey.com/product-detail/en/murata-electronics/GCM155R71C473KA37D/490-6042-1-ND/3845242?utm_source=snapeda&utm_medium=aggregator&utm_campaign=symbol; MF: Murata; MP: GCM155R71C473KA37D; PACKAGE: 1005 Taiyo Yuden
C25 = RAFT-components:GCM155R71H103KA55D: 10000pF ±10% 50V Ceramic Capacitor X7R 0402 (1005 Metric); COPYRIGHT: Copyright (C) 2015 Accelerated Designs. All rights reserved; MANUFACTURER_PART_NUMBER: GCM155R71H103KA55D; VENDOR: Murata
C26 = RAFT-components:GCM1555C1H1R5JA16D: CAP AUTO-GRADE 1.5PF 50VDC C0G 5% SMD 0402; DESCRIPTION: Cap Auto-Grade 1.5pf 50vdc C0g 5% Smd 0402; DIGI-KEY_PART_NUMBER: 490-16452-1-ND; DIGI-KEY_PURCHASE_URL: https://www.digikey.com/product-detail/en/murata-electronics/GCM1555C1H1R5JA16D/490-16452-1-ND/7363434?utm_source=snapeda&utm_medium=aggregator&utm_campaign=symbol; MF: Murata Electronics; MP: GCM1555C1H1R5JA16D; PACKAGE: 1005 Taiyo Yuden
C27 = RAFT-components:GCM1555C1H330JA16D: 33pF ±5% 50V Ceramic Capacitor C0G, NP0 0402 (1005 Metric); DESCRIPTION: CAP CER 33PF 50V C0G/NP0 0402; MF: Murata; MP: GCM1555C1H330JA16D; PACKAGE: 1005 Taiyo Yuden
C28 C29 = RAFT-components:GCM1555C1H4R7CA16D: Cap Ceramic 4.7pF 50V C0G 0.25pF SMD 0402 125°C Paper T/R; DESCRIPTION: 0402 4.7 pF 50V ±0.25 pF Tolerance C0G SMT Multilayer Ceramic Capacitor; DIGI-KEY_PART_NUMBER: 490-12652-1-ND; DIGI-KEY_PURCHASE_URL: https://www.digikey.com/product-detail/en/murata-electronics/GCM1555C1H4R7CA16D/490-12652-1-ND/5797621?utm_source=snapeda&utm_medium=aggregator&utm_campaign=symbol; MF: Murata Electronics; MP: GCM1555C1H4R7CA16D; PACKAGE: 1005 Taiyo Yuden
C30 = RAFT-components:GCM1555C1H1R8CA16D: CAP AUTO-GRADE 1.8PF 50VDC C0G 0.25PF SMD 0402; DESCRIPTION: Cap Ceramic 1.8pF 50V C0G 0.25pF Pad SMD 0402 125C Automotive T/R; DIGI-KEY_PART_NUMBER: 490-17746-1-ND; DIGI-KEY_PURCHASE_URL: https://www.digikey.com/product-detail/en/murata-electronics/GCM1555C1H1R8CA16D/490-17746-1-ND/8539982?utm_source=snapeda&utm_medium=aggregator&utm_campaign=symbol; MF: Murata Electronics; MP: GCM1555C1H1R8CA16D; PACKAGE: 1005 Taiyo Yuden
C37-C39 = rcl-raft:GCM155C71A105KE38D: Cap Ceramic 1uF 10V X7S 10% Pad SMD 0402 125C Automotive T/R; DESCRIPTION: Cap Ceramic 1uF 10V X7S 10% Pad SMD 0402 125C Automotive T/R; DIGI-KEY_PART_NUMBER: 490-13409-1-ND; DIGI-KEY_PURCHASE_URL: https://www.digikey.com/product-detail/en/murata-electronics/GCM155C71A105KE38D/490-13409-1-ND/6012281?utm_source=snapeda&utm_medium=aggregator&utm_campaign=symbol; MF: Murata; MP: GCM155C71A105KE38D; PACKAGE: 1005 Murata
C40 C50 C51 C53 C63-C65 C68 C71 = RAFT-components:GRM155C80J106ME11D: 10µF ±20% 6.3V Ceramic Capacitor X6S 0402 (1005 Metric); DESCRIPTION: 10µF ±20% 6.3V Ceramic Capacitor X6S 0402 _1005 Metric_; DIGI-KEY_PART_NUMBER: 490-13233-1-ND; DIGI-KEY_PURCHASE_URL: https://www.digikey.com/product-detail/en/murata-electronics/GRM155C80J106ME11D/490-13233-1-ND/5877441?utm_source=snapeda&utm_medium=aggregator&utm_campaign=symbol; MF: Murata Electronics; MP: GRM155C80J106ME11D; PACKAGE: 1005 Murata
C41 C42 = rcl-raft:GRM1555C1H271JA01D: Multilayer Ceramic Capacitor, GRM Series, 270 pF, 5%, C0G / NP0, 50 V, 0402 [1005 Metric]; DESCRIPTION: Multilayer Ceramic Capacitor, GRM Series, 270 pF, 5%, C0G / NP0, 50 V, 0402 [1005 Metric]; DIGI-KEY_PART_NUMBER: 490-1294-1-ND; DIGI-KEY_PURCHASE_URL: https://www.digikey.com/product-detail/en/murata-electronics/GRM1555C1H271JA01D/490-1294-1-ND/587902?utm_source=snapeda&utm_medium=aggregator&utm_campaign=symbol; MF: Murata; MP: GRM1555C1H271JA01D; PACKAGE: 1005 Taiyo Yuden
C47-C49 = RAFT-components:GRM188R60J226MEA0D: Cap Ceramic 22uF 6.3V X5R 20% Pad SMD 0603 85°C T/R; DESCRIPTION: Cap Ceramic 22uF 6.3V X5R 20% Pad SMD 0603 85°C T/R; DIGI-KEY_PART_NUMBER: 490-7611-1-ND; DIGI-KEY_PURCHASE_URL: https://www.digikey.com/product-detail/en/murata-electronics/GRM188R60J226MEA0D/490-7611-1-ND/4280544?utm_source=snapeda&utm_medium=aggregator&utm_campaign=symbol; MF: Murata; MP: GRM188R60J226MEA0D; PACKAGE: 1608 Murata
C54 C59-C61 = GCM155C71A105KE38D:GCM155C71A105KE38D: Cap Ceramic 1uF 10V X7S 10% Pad SMD 0402 125C Automotive T/R; AVAILABILITY: Unavailable; DESCRIPTION: Cap Ceramic 1uF 10V X7S 10% Pad SMD 0402 125C Automotive T/R; MF: Murata; MP: GCM155C71A105KE38D; PACKAGE: 1005 Murata; PRICE: None
C57 C66 = GRM155R60J475ME87D:GRM155R60J475ME87D: Cap Ceramic 4.7uF 6.3V X5R 20% SMD 0402 85°C Paper T/R; AVAILABILITY: Unavailable; DESCRIPTION: 4.7µF ±20% 6.3V Ceramic Capacitor X5R 0402 _1005 Metric_; MF: Murata; MP: GRM155R60J475ME87D; PACKAGE: 1005 Taiyo Yuden; PRICE: None
C58 = GRM155D80J225ME95D:GRM155D80J225ME95D: CAP CER 2.2UF 6.3V X6T 0402; DESCRIPTION: 2.2µF ±20% 6.3V Ceramic Capacitor X6T 0402 _1005 Metric_; DIGI-KEY_PART_NUMBER: 490-10450-1-ND; DIGI-KEY_PURCHASE_URL: https://www.digikey.com/product-detail/en/murata-electronics/GRM155D80J225ME95D/490-10450-1-ND/5026360?utm_source=snapeda&utm_medium=aggregator&utm_campaign=symbol; MF: Murata; MP: GRM155D80J225ME95D; PACKAGE: 1005 Taiyo Yuden
C67 = GCM1555C1H220JA16J:GCM1555C1H220JA16J: Cap Ceramic 22pF 50V C0G 5% Pad SMD 0402 125C Automotive T/R; DESCRIPTION: Cap Ceramic 22pF 50V C0G 5% Pad SMD 0402 125C Automotive T/R; DIGI-KEY_PART_NUMBER: 490-17747-1-ND; DIGI-KEY_PURCHASE_URL: https://www.digikey.com/product-detail/en/murata-electronics/GCM1555C1H220JA16J/490-17747-1-ND/8539983?utm_source=snapeda&utm_medium=aggregator&utm_campaign=symbol; MF: Murata; MP: GCM1555C1H220JA16J; PACKAGE: 1005 Taiyo Yuden
C70 = RAFT-components:GCM155R71H332KA37D: 3300pF ±10% 50V Ceramic Capacitor X7R 0402 (1005 Metric); DESCRIPTION: SMD Capacitor X7R_EIA_ with Capacitance: 3300pF Tol. 10%. Rated Voltage: 50Vdc; DIGI-KEY_PART_NUMBER: 490-8001-1-ND; DIGI-KEY_PURCHASE_URL: https://www.digikey.com/product-detail/en/murata-electronics/GCM155R71H332KA37D/490-8001-1-ND/4380286?utm_source=snapeda&utm_medium=aggregator&utm_campaign=symbol; MF: Murata; MP: GCM155R71H332KA37D; PACKAGE: 1005 Taiyo Yuden
C73 = RAFT-components:GRM155D80J225ME95D: 2.2µF ±20% 6.3V Ceramic Capacitor X6T 0402 (1005 Metric); DESCRIPTION: SMD Capacitor X6T_EIA_ with Capacitance: 2.2uF Tol. 20%. Rated Voltage: 6.3Vdc; DIGI-KEY_PART_NUMBER: 490-10450-1-ND; DIGI-KEY_PURCHASE_URL: https://www.digikey.com/product-detail/en/murata-electronics/GRM155D80J225ME95D/490-10450-1-ND/5026360?utm_source=snapeda&utm_medium=aggregator&utm_campaign=symbol; MF: Murata; MP: GRM155D80J225ME95D; PACKAGE: 1005 Taiyo Yuden
D1 D5 = PDS1040-13:PDS1040-13: PDS1040 Series 40 V 10 A Surface Mount Schottky Barrier Rectifier - PowerDI 5; AVAILABILITY: Unavailable; DESCRIPTION: Diode Schottky 40V 10A Surface Mount PowerDI™ 5; MF: Diodes Inc.; MP: PDS1040-13; PACKAGE: PowerDI™-5 Diodes Inc.; PRICE: None
D2 = diode:BAT54C: Schottky Diodes Source: Fairchild .. BAT54.pdf
D3 D4 = LTST-C190GKT:LTST-C190GKT: https://octopart.com/ltst-c190gkt-lite-on-549821; AVAILABILITY: Unavailable; DESCRIPTION: Green 569nm LED Indication - Discrete 2.1V 0603 _1608 Metric_; MF: Lite-On Inc.; MP: LTST-C190GKT; PACKAGE: 0603 Lite-On; PRICE: None
J1 J2 = AmphenolRF:AMPHENOL_132134: Rf Coaxial, Sma, Straight Jack, Pcb; AVAILABILITY: Unavailable; DESCRIPTION: RF Connector SMA Straight PCB Jack Surface Mount 50 Ohm; MF: Amphenol RF; MP: 132134-15; PACKAGE: None; PRICE: None
J3 = SparkFun-Connectors:CONN_10X2: Multi connection point. Often used as Generic Header-pin footprint for 0.1 inch spaced/style header connections On any of the 0.1 inch spaced packages, you can populate with these: Break Away Headers - Straight <https://www.sparkfun.com/products/116> (PRT-00116) Break Away Male Headers - Right Angle <https://www.sparkfun.com/products/553> (PRT-00553) Female Headers <https://www.sparkfun.com/products/115> (PRT-00115) Break Away Headers - Machine Pin <https://www.sparkfun.com/products/117> (PRT-00117) Break Away Female Headers - Swiss Machine Pin <https://www.sparkfun.com/products/743> (PRT-00743) Special note about the "SPECIAL" package: This was SPECIALLY designed to be used with our Graphic LCD Backpack. Be sure you want to use this! It is not only staggered on each line of header holes, but IT IS ALSO offset of the center point of the top and bottom lines by 5 mil. This causes the headers to lock into place on the "standard" footprint on the LCD screen. The extra squares on the tdocu layer are there simply to reference other pins (if you were to actually populate a longer header than ten long - this is what we do with the backpacks).
J4 = 105017-0001:105017-0001; DESCRIPTION: USB - micro B USB 2.0 Receptacle Connector 5 Position Surface Mount, Right Angle; Through Hole; DIGI-KEY_PART_NUMBER: WM1399CT-ND; DIGI-KEY_PURCHASE_URL: https://www.digikey.com/product-detail/en/molex/1050170001/WM1399CT-ND/2350885?utm_source=snapeda&utm_medium=aggregator&utm_campaign=symbol; MF: Molex; MP: 1050170001; PACKAGE: None
J5 = 132134-15:132134-15: Rf Coaxial, Sma, Straight Jack, Pcb; AVAILABILITY: Unavailable; DESCRIPTION: RF Connector SMA Straight PCB Jack Surface Mount 50 Ohm; MF: Amphenol RF; MP: 132134-15; PACKAGE: None; PRICE: None
L1 = rcl-raft:LQG15HS6N8J02D: 6.8nH Unshielded Multilayer Inductor 600mA 240mOhm Max 0402 (1005 Metric); BUILT_BY: EMA_TJ; COPYRIGHT: Copyright (C) 2018 Accelerated Designs. All rights reserved; MANUFACTURER_PART_NUMBER: LQG15HS6N8J02D; VENDOR: Murata
L2 = RAFT-components:LQG15HS33NJ02D: LQG Series 0402 33 nH ±5 % Tol. 200 mA SMT High Frequency Multilayer Inductor; DESCRIPTION: Inductor RF Chip Multi-Layer 33nH 5% 100MHz 8Q-Factor Air 200mA 580mOhm DCR 0402 T/R; DIGI-KEY_PART_NUMBER: 490-2629-1-ND; DIGI-KEY_PURCHASE_URL: https://www.digikey.com/product-detail/en/murata-electronics/LQG15HS33NJ02D/490-2629-1-ND/662909?utm_source=snapeda&utm_medium=aggregator&utm_campaign=symbol; MF: Murata; MP: LQG15HS33NJ02D; PACKAGE: 1005 Murata
L3 = RAFT-components:LQG15HS10NJ02D: Ind RF Chip Multi-Layer 10nH 5% 100MHz 8Q-Factor Air 300mA 0402 Paper T/R; DESCRIPTION: 10nH Unshielded Multilayer Inductor 500mA 260mOhm Max 0402 _1005 Metric_; DIGI-KEY_PART_NUMBER: 490-2623-1-ND; DIGI-KEY_PURCHASE_URL: https://www.digikey.com/product-detail/en/murata-electronics/LQG15HS10NJ02D/490-2623-1-ND/662903?utm_source=snapeda&utm_medium=aggregator&utm_campaign=symbol; MF: Murata; MP: LQG15HS10NJ02D; PACKAGE: 1005 Murata
L4 = RAFT-components:LQG15HS5N6C02D: FIXED IND 5.6NH 650MA 180 MOHM; DESCRIPTION: 5.6nH Unshielded Multilayer Inductor 650mA 180mOhm Max 0402 _1005 Metric_; DIGI-KEY_PART_NUMBER: 490-15129-1-ND; DIGI-KEY_PURCHASE_URL: https://www.digikey.com/product-detail/en/murata-electronics/LQG15HS5N6C02D/490-15129-1-ND/6799794?utm_source=snapeda&utm_medium=aggregator&utm_campaign=symbol; MF: Murata; MP: LQG15HS5N6C02D; PACKAGE: 1005 Murata
L5 = RAFT-components:LQG15HS8N2J02D: Ind RF Chip Multi-Layer 8.2nH 5% 100MHz 8Q-Factor Air 300mA 0402 Paper T/R; DESCRIPTION: Inductor RF Chip Multi-Layer 8.2nH 5% 100MHz 8Q-Factor Air 300mA 240mOhm DCR 0402 T/R; DIGI-KEY_PART_NUMBER: 490-2622-6-ND; DIGI-KEY_PURCHASE_URL: https://www.digikey.com/product-detail/en/murata-electronics/LQG15HS8N2J02D/490-2622-6-ND/1825762?utm_source=snapeda&utm_medium=aggregator&utm_campaign=symbol; MF: Murata; MP: LQG15HS8N2J02D; PACKAGE: 1005 Murata
L6 = RAFT-components:LQG15HN7N5H02D: FIXED IND 7.5NH 500MA 240 MOHM; DESCRIPTION: Fixed Ind 7.5nh 500ma 240 Mohm; DIGI-KEY_PART_NUMBER: 490-15095-1-ND; DIGI-KEY_PURCHASE_URL: https://www.digikey.com/product-detail/en/murata-electronics/LQG15HN7N5H02D/490-15095-1-ND/6799760?utm_source=snapeda&utm_medium=aggregator&utm_campaign=symbol; MF: Murata; MP: LQG15HN7N5H02D; PACKAGE: 1005 Murata
L7 = rcl-raft:LQG15HN2N0C02D: FIXED IND 2NH 900MA 90 MOHM; DESCRIPTION: Fixed Ind 2nh 900ma 90 Mohm; DIGI-KEY_PART_NUMBER: 490-15076-1-ND; DIGI-KEY_PURCHASE_URL: https://www.digikey.com/product-detail/en/murata-electronics/LQG15HN2N0C02D/490-15076-1-ND/6799741?utm_source=snapeda&utm_medium=aggregator&utm_campaign=symbol; MF: Murata; MP: LQG15HN2N0C02D; PACKAGE: 1005 Murata
L8 = rcl-raft:LQG15HS5N6C02D: FIXED IND 5.6NH 650MA 180 MOHM; DESCRIPTION: 5.6nH Unshielded Multilayer Inductor 650mA 180mOhm Max 0402 _1005 Metric_; DIGI-KEY_PART_NUMBER: 490-15129-1-ND; DIGI-KEY_PURCHASE_URL: https://www.digikey.com/product-detail/en/murata-electronics/LQG15HS5N6C02D/490-15129-1-ND/6799794?utm_source=snapeda&utm_medium=aggregator&utm_campaign=symbol; MF: Murata; MP: LQG15HS5N6C02D; PACKAGE: 1005 Murata
L9 = RAFT-components:LQM18PN1R5MFRL: FIXED IND 1.5UH 800MA 288 MOHM; DESCRIPTION: FIXED IND 1.5UH 800MA 288 MOHM; DIGI-KEY_PART_NUMBER: 490-17890-1-ND; DIGI-KEY_PURCHASE_URL: https://www.digikey.com/product-detail/en/murata-electronics/LQM18PN1R5MFRL/490-17890-1-ND/8540126?utm_source=snapeda&utm_medium=aggregator&utm_campaign=symbol; MF: Murata; MP: LQM18PN1R5MFRL; PACKAGE: 1608 Murata
L10 = RAFT-components:LQM18FN100M00D: Inductor Power Chip Shielded Multi-Layer 10uH 20% 1MHz Ferrite 50mA 1.17Ohm DCR 0603 T/R; DESCRIPTION: 10µH Shielded Multilayer Inductor 50mA 1.17Ohm Max 0603 _1608 Metric_; DIGI-KEY_PART_NUMBER: 490-4025-1-ND; DIGI-KEY_PURCHASE_URL: https://www.digikey.com/product-detail/en/murata-electronics/LQM18FN100M00D/490-4025-1-ND/1016285?utm_source=snapeda&utm_medium=aggregator&utm_campaign=symbol; MF: Murata Electronics; MP: LQM18FN100M00D; PACKAGE: 1608 Murata
Q1 = RAFT-components:SIA817EDJ: P-Channel 30V 4.5A (Tc) 1.9W (Ta), 6.5W (Tc) Surface Mount PowerPAK® SC-70-6 Dual
Q2 Q4 = RAFT-components:SI7288DP: Trans MOSFET N-CH 40V 10An Vishay SI7288DP-T1-GE3 Dual N-channel MOSFET Transistor, 20 A, 40 V, 8-Pin PowerPAK SO Source: Datasheet <https://www.vishay.com/docs/65366/si7288dp.pdf>; ALLIED_NUMBER: 70459563; ALLIED_PRICE-STOCK: https://www.alliedelec.com/siliconix-vishay-si7288dp-t1-ge3/70459563/; DESCRIPTION: Trans MOSFET N-CH 40V 10An Vishay SI7288DP-T1-GE3 Dual N-channel MOSFET Transistor, 20 A, 40 V, 8-Pin PowerPAK SO; HEIGHT: mm; MANUFACTURER_NAME: Vishay; MANUFACTURER_PART_NUMBER: SI7288DP-T1-GE3; MOUSER_PART_NUMBER: 781-SI7288DP-T1-GE3; MOUSER_PRICE-STOCK: https://www.mouser.com/Search/Refine.aspx?Keyword=781-SI7288DP-T1-GE3; RS_PART_NUMBER: 8181390P; RS_PRICE-STOCK: http://uk.rs-online.com/web/p/products/8181390P
R1 = rcl-raft:CRCW040215K0JNED: Res Thick Film 0402 15K Ohm 5% 1/16W ±200ppm/°C Molded SMD SMD Paper T/R; DESCRIPTION: Res Thick Film 0402 15K Ohm 5% 0.063W_1/16W_ ±200ppm/C Molded SMD Automotive Paper T/R; DIGI-KEY_PART_NUMBER: 541-15KJCT-ND; DIGI-KEY_PURCHASE_URL: https://www.digikey.com/product-detail/en/vishay-dale/CRCW040215K0JNED/541-15KJCT-ND/1182712?utm_source=snapeda&utm_medium=aggregator&utm_campaign=symbol; MF: Vishay Dale; MP: CRCW040215K0JNED; PACKAGE: 1005 Panasonic Electronic Components
R2-R4 = rcl-raft:CRCW04020000Z0ED: RESISTOR, 0402, 0R, FULL REEL; DESCRIPTION: 0 Ohms Jumper 0.063W, 1/16W Chip Resistor 0402 _1005 Metric_ Automotive AEC-Q200 Thick Film; DIGI-KEY_PART_NUMBER: 541-0.0JCT-ND; DIGI-KEY_PURCHASE_URL: https://www.digikey.com/product-detail/en/vishay-dale/CRCW04020000Z0ED/541-0.0JCT-ND/1182611?utm_source=snapeda&utm_medium=aggregator&utm_campaign=symbol; MF: Vishay; MP: CRCW04020000Z0ED; PACKAGE: 1005 Panasonic Electronic Components
R5 R10 R19 R21 R22 = RAFT-components:CRCW0402100KFKED: RES, THICK FILM, 100K, 1%, 0.063W, 0402; DESCRIPTION: 100 kOhms ±1% 0.063W, 1/16W Chip Resistor 0402 _1005 Metric_ Automotive AEC-Q200 Thick Film; DIGI-KEY_PART_NUMBER: 541-100KLCT-ND; DIGI-KEY_PURCHASE_URL: https://www.digikey.com/product-detail/en/vishay-dale/CRCW0402100KFKED/541-100KLCT-ND/1183351?utm_source=snapeda&utm_medium=aggregator&utm_campaign=symbol; MF: Vishay; MP: CRCW0402100KFKED; PACKAGE: 1005 Panasonic Electronic Components
R6 = RAFT-components:CRCW0402470KFKEDC; DESCRIPTION: D10/CRCW0402-C 100 470K 1% ET7; DIGI-KEY_PART_NUMBER: 541-4081-1-ND; DIGI-KEY_PURCHASE_URL: https://www.digikey.com/product-detail/en/vishay-dale/CRCW0402470KFKEDC/541-4081-1-ND/7928764?utm_source=snapeda&utm_medium=aggregator&utm_campaign=symbol; MF: Vishay; MP: CRCW0402470KFKEDC; PACKAGE: 1005 Yageo
R7 = RAFT-components:CRCW0402150KFKEDC; DESCRIPTION: Res Thick Film 0402 150K Ohm 1% 0.063W_1/16W_ ±100ppm/°C Pad SMD T/R; DIGI-KEY_PART_NUMBER: 541-4008-1-ND; DIGI-KEY_PURCHASE_URL: https://www.digikey.com/product-detail/en/vishay-dale/CRCW0402150KFKEDC/541-4008-1-ND/7928691?utm_source=snapeda&utm_medium=aggregator&utm_campaign=symbol; MF: Vishay Dale; MP: CRCW0402150KFKEDC; PACKAGE: 1005 Yageo
R8 = CRCW04024K70JNEDC:CRCW04024K70JNEDC: D10/CRCW0402-C 200 4K7 5% ET7; DESCRIPTION: D10/CRCW0402-C 200 4K7 5% ET7; DIGI-KEY_PART_NUMBER: 541-3974-1-ND; DIGI-KEY_PURCHASE_URL: https://www.digikey.com/product-detail/en/vishay-dale/CRCW04024K70JNEDC/541-3974-1-ND/7928657?utm_source=snapeda&utm_medium=aggregator&utm_campaign=symbol; MF: Vishay; MP: CRCW04024K70JNEDC; PACKAGE: 1005 Yageo
R9 R23 R24 R27 = RAFT-components:CRCW040210K0JNED: RES, THICK FILM, 10K, 5%, 0.063W, 0402,; DESCRIPTION: 10 kOhms ±5% 0.063W, 1/16W Chip Resistor 0402 _1005 Metric_ Automotive AEC-Q200 Thick Film; DIGI-KEY_PART_NUMBER: 541-10KJCT-ND; DIGI-KEY_PURCHASE_URL: https://www.digikey.com/product-detail/en/vishay-dale/CRCW040210K0JNED/541-10KJCT-ND/1182708?utm_source=snapeda&utm_medium=aggregator&utm_campaign=symbol; MF: Vishay Dale; MP: CRCW040210K0JNED; PACKAGE: 1005 Panasonic Electronic Components
R11 R12 = RAFT-components:CRCW0402499RFKEDC: 499 Ohms ±1% 0.063W, 1/16W Chip Resistor 0402 (1005 Metric) Thick Film; DESCRIPTION: Res Thick Film 0402 499 Ohm 1% 0.063W_1/16W_ ±100ppm/°C Pad SMD T/R; DIGI-KEY_PART_NUMBER: 541-4007-1-ND; DIGI-KEY_PURCHASE_URL: https://www.digikey.com/product-detail/en/vishay-dale/CRCW0402499RFKEDC/541-4007-1-ND/7928690?utm_source=snapeda&utm_medium=aggregator&utm_campaign=symbol; MF: Vishay; MP: CRCW0402499RFKEDC; PACKAGE: 1005 Yageo
R13 = CRCW040236K0FKED:CRCW040236K0FKED: Surface Mount Thick Film Resistor, AEC-Q200 CRCW Series, 36 kohm, 63 mW, - 1%, 50 V; DESCRIPTION: Surface Mount Thick Film Resistor, AEC-Q200 CRCW Series, 36 kohm, 63 mW, - 1%, 50 V; DIGI-KEY_PART_NUMBER: 541-36.0KLCT-ND; DIGI-KEY_PURCHASE_URL: https://www.digikey.com/product-detail/en/vishay-dale/CRCW040236K0FKED/541-36.0KLCT-ND/1183299?utm_source=snapeda&utm_medium=aggregator&utm_campaign=symbol; MF: Vishay; MP: CRCW040236K0FKED; PACKAGE: 1005 Panasonic Electronic Components
R14 = CRCW04022K00FKED:CRCW04022K00FKED: RESISTOR, 0402, 2K, 1%, FULL REEL; DESCRIPTION: 2 kOhms ±1% 0.063W, 1/16W Chip Resistor 0402 _1005 Metric_ Automotive AEC-Q200 Thick Film; DIGI-KEY_PART_NUMBER: 541-2.00KLCT-ND; DIGI-KEY_PURCHASE_URL: https://www.digikey.com/product-detail/en/vishay-dale/CRCW04022K00FKED/541-2.00KLCT-ND/1183155?utm_source=snapeda&utm_medium=aggregator&utm_campaign=symbol; MF: Vishay Dale; MP: CRCW04022K00FKED; PACKAGE: 1005 Panasonic Electronic Components
R15 = CRCW040210R0JNEDC:CRCW040210R0JNEDC; DESCRIPTION: D10/CRCW0402-C 200 10R 5% ET7; DIGI-KEY_PART_NUMBER: 541-4122-1-ND; DIGI-KEY_PURCHASE_URL: https://www.digikey.com/product-detail/en/vishay-dale/CRCW040210R0JNEDC/541-4122-1-ND/7928805?utm_source=snapeda&utm_medium=aggregator&utm_campaign=symbol; MF: Vishay; MP: CRCW040210R0JNEDC; PACKAGE: 1005 Yageo
R16 R17 = CRCW040210K0JNED:CRCW040210K0JNED: RES, THICK FILM, 10K, 5%, 0.063W, 0402,; DESCRIPTION: 10 kOhms ±5% 0.063W, 1/16W Chip Resistor 0402 _1005 Metric_ Automotive AEC-Q200 Thick Film; DIGI-KEY_PART_NUMBER: 541-10KJCT-ND; DIGI-KEY_PURCHASE_URL: https://www.digikey.com/product-detail/en/vishay-dale/CRCW040210K0JNED/541-10KJCT-ND/1182708?utm_source=snapeda&utm_medium=aggregator&utm_campaign=symbol; MF: Vishay Dale; MP: CRCW040210K0JNED; PACKAGE: 1005 Panasonic Electronic Components
R18 = rcl-raft:CRCW0402499RFKEDC: 499 Ohms ±1% 0.063W, 1/16W Chip Resistor 0402 (1005 Metric) Thick Film; DESCRIPTION: Res Thick Film 0402 499 Ohm 1% 0.063W_1/16W_ ±100ppm/°C Pad SMD T/R; DIGI-KEY_PART_NUMBER: 541-4007-1-ND; DIGI-KEY_PURCHASE_URL: https://www.digikey.com/product-detail/en/vishay-dale/CRCW0402499RFKEDC/541-4007-1-ND/7928690?utm_source=snapeda&utm_medium=aggregator&utm_campaign=symbol; MF: Vishay; MP: CRCW0402499RFKEDC; PACKAGE: 1005 Yageo
R20 = RAFT-components:CRCW040220K0FKEDC: 20 kOhms ±1% 0.063W, 1/16W Chip Resistor 0402 (1005 Metric) Thick Film; DESCRIPTION: 20 kOhms ±1% 0.063W, 1/16W Chip Resistor 0402 _1005 Metric_ Thick Film; DIGI-KEY_PART_NUMBER: 541-3969-1-ND; DIGI-KEY_PURCHASE_URL: https://www.digikey.com/product-detail/en/vishay-dale/CRCW040220K0FKEDC/541-3969-1-ND/7928652?utm_source=snapeda&utm_medium=aggregator&utm_campaign=symbol; MF: Vishay; MP: CRCW040220K0FKEDC; PACKAGE: 1005 Yageo
R25 = RAFT-components:CRCW04025K23FKED: CRCW Series 0402 0.063 W 5.23 kOhm ±1 % ±100 ppm/K SMT Thick Film Chip Resistor; DESCRIPTION: 5.23 kOhms ±1% 0.063W, 1/16W Chip Resistor 0402 _1005 Metric_ Automotive AEC-Q200 Thick Film; DIGI-KEY_PART_NUMBER: 541-5.23KLCT-ND; DIGI-KEY_PURCHASE_URL: https://www.digikey.com/product-detail/en/vishay-dale/CRCW04025K23FKED/541-5.23KLCT-ND/1183205?utm_source=snapeda&utm_medium=aggregator&utm_campaign=symbol; MF: Vishay Dale; MP: CRCW04025K23FKED; PACKAGE: 1005 Panasonic Electronic Components
R26 = RAFT-components:CRCW040230K1FKED: Res Thick Film 0402 30.1K Ohm 1% 1/16W ±100ppm/°C Molded SMD Paper T/R; DESCRIPTION: Res Thick Film 0402 30.1K Ohm 1% 0.063W_1/16W_ ±100ppm/C Molded SMD Automotive Paper T/R; DIGI-KEY_PART_NUMBER: 541-30.1KLCT-ND; DIGI-KEY_PURCHASE_URL: https://www.digikey.com/product-detail/en/vishay-dale/CRCW040230K1FKED/541-30.1KLCT-ND/1183290?utm_source=snapeda&utm_medium=aggregator&utm_campaign=symbol; MF: Vishay; MP: CRCW040230K1FKED; PACKAGE: 1005 Panasonic Electronic Components
R_SR = ERJ-3BWFR020V:ERJ-3BWFR020V; DESCRIPTION: Res Thick Film 0603 0.02 Ohm 1% 0.25W_1/4W_ ±250ppm/C Pad SMD Automotive T/R; DIGI-KEY_PART_NUMBER: P17461CT-ND; DIGI-KEY_PURCHASE_URL: https://www.digikey.com/product-detail/en/panasonic-electronic-components/ERJ-3BWFR020V/P17461CT-ND/5647945?utm_source=snapeda&utm_medium=aggregator&utm_campaign=symbol; MF: Panasonic; MP: ERJ-3BWFR020V; PACKAGE: 1608 Panasonic Electronic Components
S1 S2 = SparkFun-Switches:MOMENTARY-SWITCH-SPST: Momentary Switch (Pushbutton) - SPST Normally-open (NO) SPST momentary switches (buttons, pushbuttons). Variants PTH-12MM - 12mm square, through-hole Momentary Pushbutton Switch - 12mm Square <https://www.sparkfun.com/products/9190> (COM-09190) PTH-6.0MM, PTH-6.0MM-KIT - 6.0mm square, through-hole Mini Pushbutton Switch <https://www.sparkfun.com/products/97> (COM-00097) KIT package intended for soldering kit's - only one side of pads' copper is exposed. PTH-RIGHT-ANGLE-KIT - Right-angle, through-hole Right Angle Tactile Button <https://www.sparkfun.com/products/10791> - Used on SparkFun BigTime Watch Kit <https://www.sparkfun.com/products/11734> SMD-12MM - 12mm square, surface-mount Tactile Button - SMD (12mm) <https://www.sparkfun.com/products/12993> (COM-12993) Used on SparkFun PicoBoard <https://www.sparkfun.com/products/11888> SMD-4.5MM - 4.5mm Square Trackball Switch Used on SparkFun Blackberry Trackballer Breakout <https://www.sparkfun.com/products/13169> SMD-4.6MMX2.8MM - 4.60mm x 2.80mm, surface mount Used on SparkFun SAMD21 Mini Breakout <https://www.sparkfun.com/products/13664> SMD-5.2MM, SMD-5.2-REDUNDANT - 5.2mm square, surface-mount Mini Pushbutton Switch - SMD <https://www.sparkfun.com/products/8720> (COM-08720) Used on Arduino Pro Mini <https://www.sparkfun.com/products/11114> REDUNDANT package connects both switch circuits together SMD-6.0X3.5MM - 6.0 x 3.5mm, surface mount Momentary Reset Switch SMD <https://www.sparkfun.com/products/8229> (COM-08229) SMD-6.2MM-TALL - 6.2mm square, surface mount Tactile Button - SMD (6mm) <https://www.sparkfun.com/products/12992> Used on SparkFun Digital Sandbox <https://www.sparkfun.com/products/12651> SMD-RIGHT-ANGLE - Right-angle, surface mount Used on SparkFun Block for Intel® Edison - Arduino <https://www.sparkfun.com/products/13036>; PROD_ID: SWCH-08441; SF_SKU: COM-00097
U1 = Semtech-rf:SX1276: RF Transceiver FSK/GFSK/MSK/GMSK/LoRa/OOK 137MHz to 1020MHz 28-Pin QFN; AVAILABILITY: Unavailable; DESCRIPTION: RF Transceiver FSK/GFSK/MSK/GMSK/LoRa/OOK 137MHz to 1020MHz 28-Pin QFN; MF: Semtech Corporation; MP: SX1276; PACKAGE: VQFN-28 Semtech Corporation; PRICE: None
U2 = MAX2771ETI_:MAX2771ETI+: None; AVAILABILITY: Unavailable; DESCRIPTION: NEXT-GENERATION GLOBAL NAVIGATIO; MF: Maxim Integrated; MP: MAX2771ETI+; PACKAGE: TQFN-28 Maxim; PRICE: None
U3 = Espressif:ESP32-D0WD: ESP32 is a single 2.4 GHz Wi-Fi-and-Bluetooth combo chip designed with the TSMC ultra-low-power 40 nm technology. It is designed to achieve the best power and RF performance, showing robustness, versatility and reliability in a wide variety of applications and power scenarios.; AVAILABILITY: Unavailable; DESCRIPTION: Smd Ic Esp32-D0wd, Dual Core Mcu; MF: Espressif Systems; MP: ESP32-D0WD; PACKAGE: VFQFN-48 Espressif Systems; PRICE: None
U4 = Winbond:W25Q16BVSSIG: Flash, pin, soic, flash, Memory, Semiconductors and Actives, serial, ic; AVAILABILITY: Unavailable; DESCRIPTION: FLASH - NOR Memory IC 16Mb _2M x 8_ SPI 104MHz 8-SOIC; MF: Winbond; MP: W25Q16BVSSIG; PACKAGE: SOIC-8 Winbond; PRICE: None
U5 = INTERFACE-CP2102-GMR_QFN28_:INTERFACE-CP2102-GMR(QFN28): 310070003; AVAILABILITY: Unavailable; DESCRIPTION: USB Bridge, USB to UART USB 2.0 UART Interface 28-QFN _5x5_; MF: Silicon; MP: CP2102-GMR; PACKAGE: VFQFN-28 Vishay Siliconix; PRICE: None
U6 = PE4259:PE4259: SPDT High Power UltraCMOS 10 MHz–3.0 GHz RF Switch; AVAILABILITY: Unavailable; MF: pSemi; MP: PE4259; PACKAGE: SOT-363 Peregrine Semiconductor; PRICE: None
U7 = SP0503BAHT:SP0503BAHT; DESCRIPTION: 8.5V Clamp Ipp Tvs Diode Surface Mount SOT-143-4; DIGI-KEY_PART_NUMBER: SP0503BAHT-ND; DIGI-KEY_PURCHASE_URL: https://www.digikey.com/product-detail/en/littelfuse-inc/SP0503BAHT/SP0503BAHT-ND/485122?utm_source=snapeda&utm_medium=aggregator&utm_campaign=symbol; MF: Littelfuse Inc.; MP: SP0503BAHT; PACKAGE: SOT-143 Littelfuse
U8 = TexasInstruments:BQ24650RVAR: Synchronous Switch-Mode Battery Charge Controller; AVAILABILITY: Unavailable; DESCRIPTION: Charger IC Multi-Chemistry 16-VQFN _3.5x3.5_; MF: Texas Instruments; MP: BQ24650RVAR; PACKAGE: VFQFN-16 Murata Power Solutions; PRICE: None
U9 = TPS63070RNMT:TPS63070RNMT: Wide Input Voltage (2V-16V) Buck-Boost Converter 15-VQFN-HR; AVAILABILITY: Unavailable; DESCRIPTION: Conv DC-DC 2V to 16V Step Down/Step Up Single-Out 2.5V to 9V 2A 15-Pin VQFN-HR T/R; MF: Texas Instruments; MP: TPS63070RNMT; PACKAGE: VQFN-15 Texas Instruments; PRICE: None
U10 = PeregrineSemi:PE4259: SPDT High Power UltraCMOS 10 MHz–3.0 GHz RF Switch; AVAILABILITY: Unavailable; MF: pSemi; MP: PE4259; PACKAGE: SOT-363 Peregrine Semiconductor; PRICE: None
U$1 = rcl-raft:NX2016SA-32M: 32MHz Crystal 10pF 60 Ohms 4-SMD, No Lead; MANUFACTURER: NDK America, Inc.
U$2 = RAFT-components:NX2016SA-32M: 32MHz Crystal 10pF 60 Ohms 4-SMD, No Lead; MANUFACTURER: NDK America, Inc.
U$3 = rcl-raft:R2520-40: 40MHz ±10ppm Crystal 12pF 60 Ohms 4-SMD, No Lead; MANUFACTURER: NDK America, Inc.
Y1 = rcl-raft:FC-13532.768KA-AG0: FC-135 series 32.768kHz ±20ppm Crystal 9pF 50 kOhms, -40°C ~ 85°C, Surface Mount 2-SMD, No Lead; AVAILABILITY: Unavailable; DESCRIPTION: FC-135 series 32.768kHz ±20ppm Crystal 9pF 50 kOhms, -40°C ~ 85°C, Surface Mount 2-SMD, No Lead; MF: EPSON; MP: FC-135R 32.7680KA-AC3; PACKAGE: SMD-2 Epson; PRICE: None